# EAGLE design TestV3 (EAGLE 9.5.2)

## Sheet 1 of 3: STM32 MCU
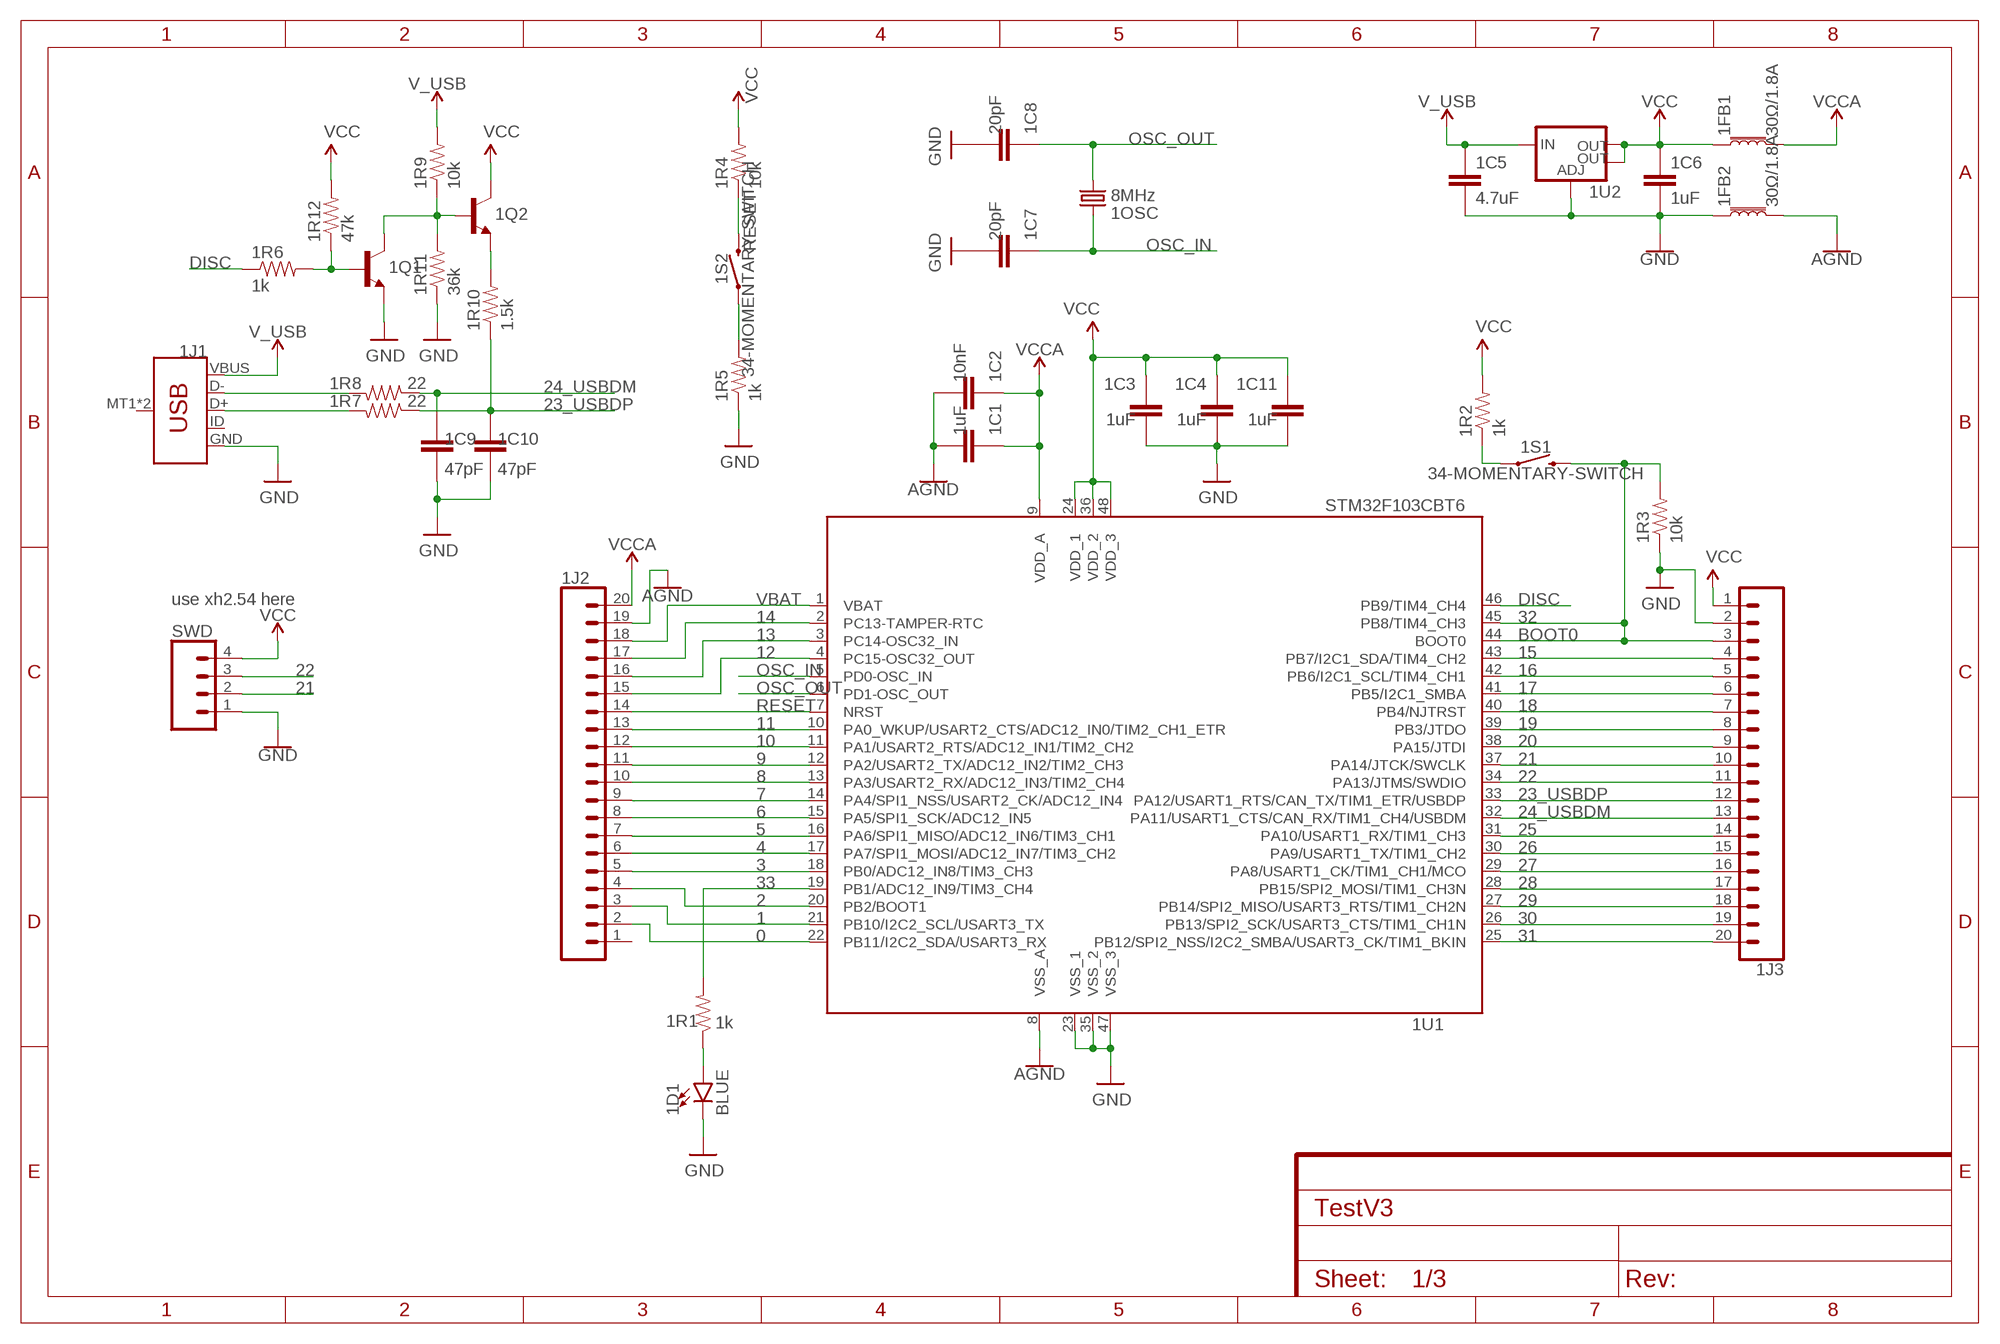
[diagram p0: schematic, sheet 1]

### Parts
1C1  1uF  CAPACITOR0603  [C0603]
1C2  10nF  CAPACITOR0603  [C0603]
1C3  1uF  CAPACITOR0603  [C0603]
1C4  1uF  CAPACITOR0603  [C0603]
1C5  4.7uF  CAPACITOR0603  [C0603]
1C6  1uF  CAPACITOR0603  [C0603]
1C7  20pF  CAPACITOR0603  [C0603]
1C8  20pF  CAPACITOR0603  [C0603]
1C9  47pF  CAPACITOR0603  [C0603]
1C10  47pF  CAPACITOR0603  [C0603]
1C11  1uF  CAPACITOR0603  [C0603]
1D1  BLUE  LED-BLUE0603  [LED-0603]
1FB1  30Ω/1.8A  FERRITE_BEAD-0603  [0603]
1FB2  30Ω/1.8A  FERRITE_BEAD-0603  [0603]
1J1  USB-MICROB  [USB-MICROB]
1J2  CONN_20LOCK  [1X20_LOCK]
1J3  CONN_20LOCK  [1X20_LOCK]
1OSC  8MHz  CRYSTALSMD-5X3.2-2PAD  [CRYSTAL-SMD-5X3.2-2PAD]
1Q1  600mA/40V  TRANS_NPN-MMBT2222AL  [SOT23-3]
1Q2  600mA/40V  TRANS_NPN-MMBT2222AL  [SOT23-3]
1R1  1k  RESISTOR0603  [R0603]
1R2  1k  RESISTOR0603  [R0603]
1R3  10k  RESISTOR0603  [R0603]
1R4  10k  RESISTOR0603  [R0603]
1R5  1k  RESISTOR0603  [R0603]
1R6  1k  RESISTOR0603  [R0603]
1R7  22  RESISTOR0603  [R0603]
1R8  22  RESISTOR0603  [R0603]
1R9  10k  RESISTOR0603  [R0603]
1R10  1.5k  RESISTOR0603  [R0603]
1R11  36k  RESISTOR0603  [R0603]
1R12  47k  RESISTOR0603  [R0603]
1S1  34-MOMENTARY-SWITCH  [3*4-MOMENTARY-SWITCH]
1S2  34-MOMENTARY-SWITCH  [3*4-MOMENTARY-SWITCH]
1U1  STM32F103CBT6  [LQFP48]
1U2  V_REG_LM1117SOT223  [SOT223]
SWD  CONN_04LOCK  [1X04_LOCK]

### Nets
0: 1J2.2 1U1.22(PB11/I2C2_SDA/USART3_RX)
1: 1J2.3 1U1.21(PB10/I2C2_SCL/USART3_TX)
2: 1J2.4 1U1.20(PB2/BOOT1)
3: 1J2.5 1U1.18(PB0/ADC12_IN8/TIM3_CH3)
4: 1J2.6 1U1.17(PA7/SPI1_MOSI/ADC12_IN7/TIM3_CH2)
5: 1J2.7 1U1.16(PA6/SPI1_MISO/ADC12_IN6/TIM3_CH1)
6: 1J2.8 1U1.15(PA5/SPI1_SCK/ADC12_IN5)
7: 1J2.9 1U1.14(PA4/SPI1_NSS/USART2_CK/ADC12_IN4)
8: 1J2.10 1U1.13(PA3/USART2_RX/ADC12_IN3/TIM2_CH4)
9: 1J2.11 1U1.12(PA2/USART2_TX/ADC12_IN2/TIM2_CH3)
10: 1J2.12 1U1.11(PA1/USART2_RTS/ADC12_IN1/TIM2_CH2)
11: 1J2.13 1U1.10(PA0_WKUP/USART2_CTS/ADC12_IN0/TIM2_CH1_ETR)
12: 1J2.15 1U1.4(PC15-OSC32_OUT)
13: 1J2.16 1U1.3(PC14-OSC32_IN)
14: 1J2.17 1U1.2(PC13-TAMPER-RTC)
15: 1J3.4 1U1.43(PB7/I2C1_SDA/TIM4_CH2)
16: 1J3.5 1U1.42(PB6/I2C1_SCL/TIM4_CH1)
17: 1J3.6 1U1.41(PB5/I2C1_SMBA)
18: 1J3.7 1U1.40(PB4/NJTRST)
19: 1J3.8 1U1.39(PB3/JTDO)
20: 1J3.9 1U1.38(PA15/JTDI)
21: 1J3.10 1U1.37(PA14/JTCK/SWCLK) SWD.2
22: 1J3.11 1U1.34(PA13/JTMS/SWDIO) SWD.3
23_USBDP: 1C10.2 1J3.12 1R7.1 1R10.1 1U1.33(PA12/USART1_RTS/CAN_TX/TIM1_ETR/USBDP)
24_USBDM: 1C9.2 1J3.13 1R8.1 1U1.32(PA11/USART1_CTS/CAN_RX/TIM1_CH4/USBDM)
25: 1J3.14 1U1.31(PA10/USART1_RX/TIM1_CH3)
26: 1J3.15 1U1.30(PA9/USART1_TX/TIM1_CH2)
27: 1J3.16 1U1.29(PA8/USART1_CK/TIM1_CH1/MCO)
28: 1J3.17 1U1.28(PB15/SPI2_MOSI/TIM1_CH3N)
29: 1J3.18 1U1.27(PB14/SPI2_MISO/USART3_RTS/TIM1_CH2N)
30: 1J3.19 1U1.26(PB13/SPI2_SCK/USART3_CTS/TIM1_CH1N)
31: 1J3.20 1U1.25(PB12/SPI2_NSS/I2C2_SMBA/USART3_CK/TIM1_BKIN)
32: 1J3.3 1R3.2 1S1.P2 1U1.44(BOOT0) 1U1.45(PB8/TIM4_CH3)
33: 1R1.2 1U1.19(PB1/ADC12_IN9/TIM3_CH4)
AGND: 1C1.2 1C2.2 1FB2.2 1J2.19 1U1.8(VSS_A)
DISC: 1R6.1 1U1.46(PB9/TIM4_CH4)
GND: 1C3.2 1C4.2 1C5.2 1C6.2 1C7.2 1C8.2 1C9.1 1C10.1 1C11.2 1D1.C 1FB2.1 1J1.GND 1J3.2 1Q1.2(E) 1R3.1 1R5.1 1R11.1 1U1.23(VSS_1) 1U1.35(VSS_2) 1U1.47(VSS_3) 1U2.1(ADJ) SWD.1
N$1: 1R2.1 1S1.P1
N$2: 1D1.A 1R1.1
N$4: 1R5.2 1S2.P1
N$51: 1Q2.2(E) 1R10.2
N$59: 1J1.D- 1R8.2
N$60: 1J1.D+ 1R7.2
N$71: 1Q1.3(C) 1Q2.1(B) 1R9.1 1R11.2
N$73: 1Q1.1(B) 1R6.2 1R12.1
OSC_IN: 1C7.1 1OSC.P$2 1U1.5(PD0-OSC_IN)
OSC_OUT: 1C8.1 1OSC.P$1 1U1.6(PD1-OSC_OUT)
RESET: 1J2.14 1R4.1 1S2.P2 1U1.7(NRST)
V_USB: 1C5.1 1J1.VBUS 1R9.2 1U2.3(IN)
VBAT: 1J2.18 1U1.1(VBAT)
VCC: 1C3.1 1C4.1 1C6.1 1C11.1 1FB1.1 1J3.1 1Q2.3(C) 1R2.2 1R4.2 1R12.2 1U1.24(VDD_1) 1U1.36(VDD_2) 1U1.48(VDD_3) 1U2.2(OUT) 1U2.4(OUT) SWD.4
VCCA: 1C1.1 1C2.1 1FB1.2 1J2.20 1U1.9(VDD_A)
Unconnected: 1J1.ID 1J1.MT1(SHIELD) 1J1.MT2(SHIELD) 1J2.1

### Notes on the sheet
- use xh2.54 here
- BOOT0

## Sheet 2 of 3: Buck & Boost Converters
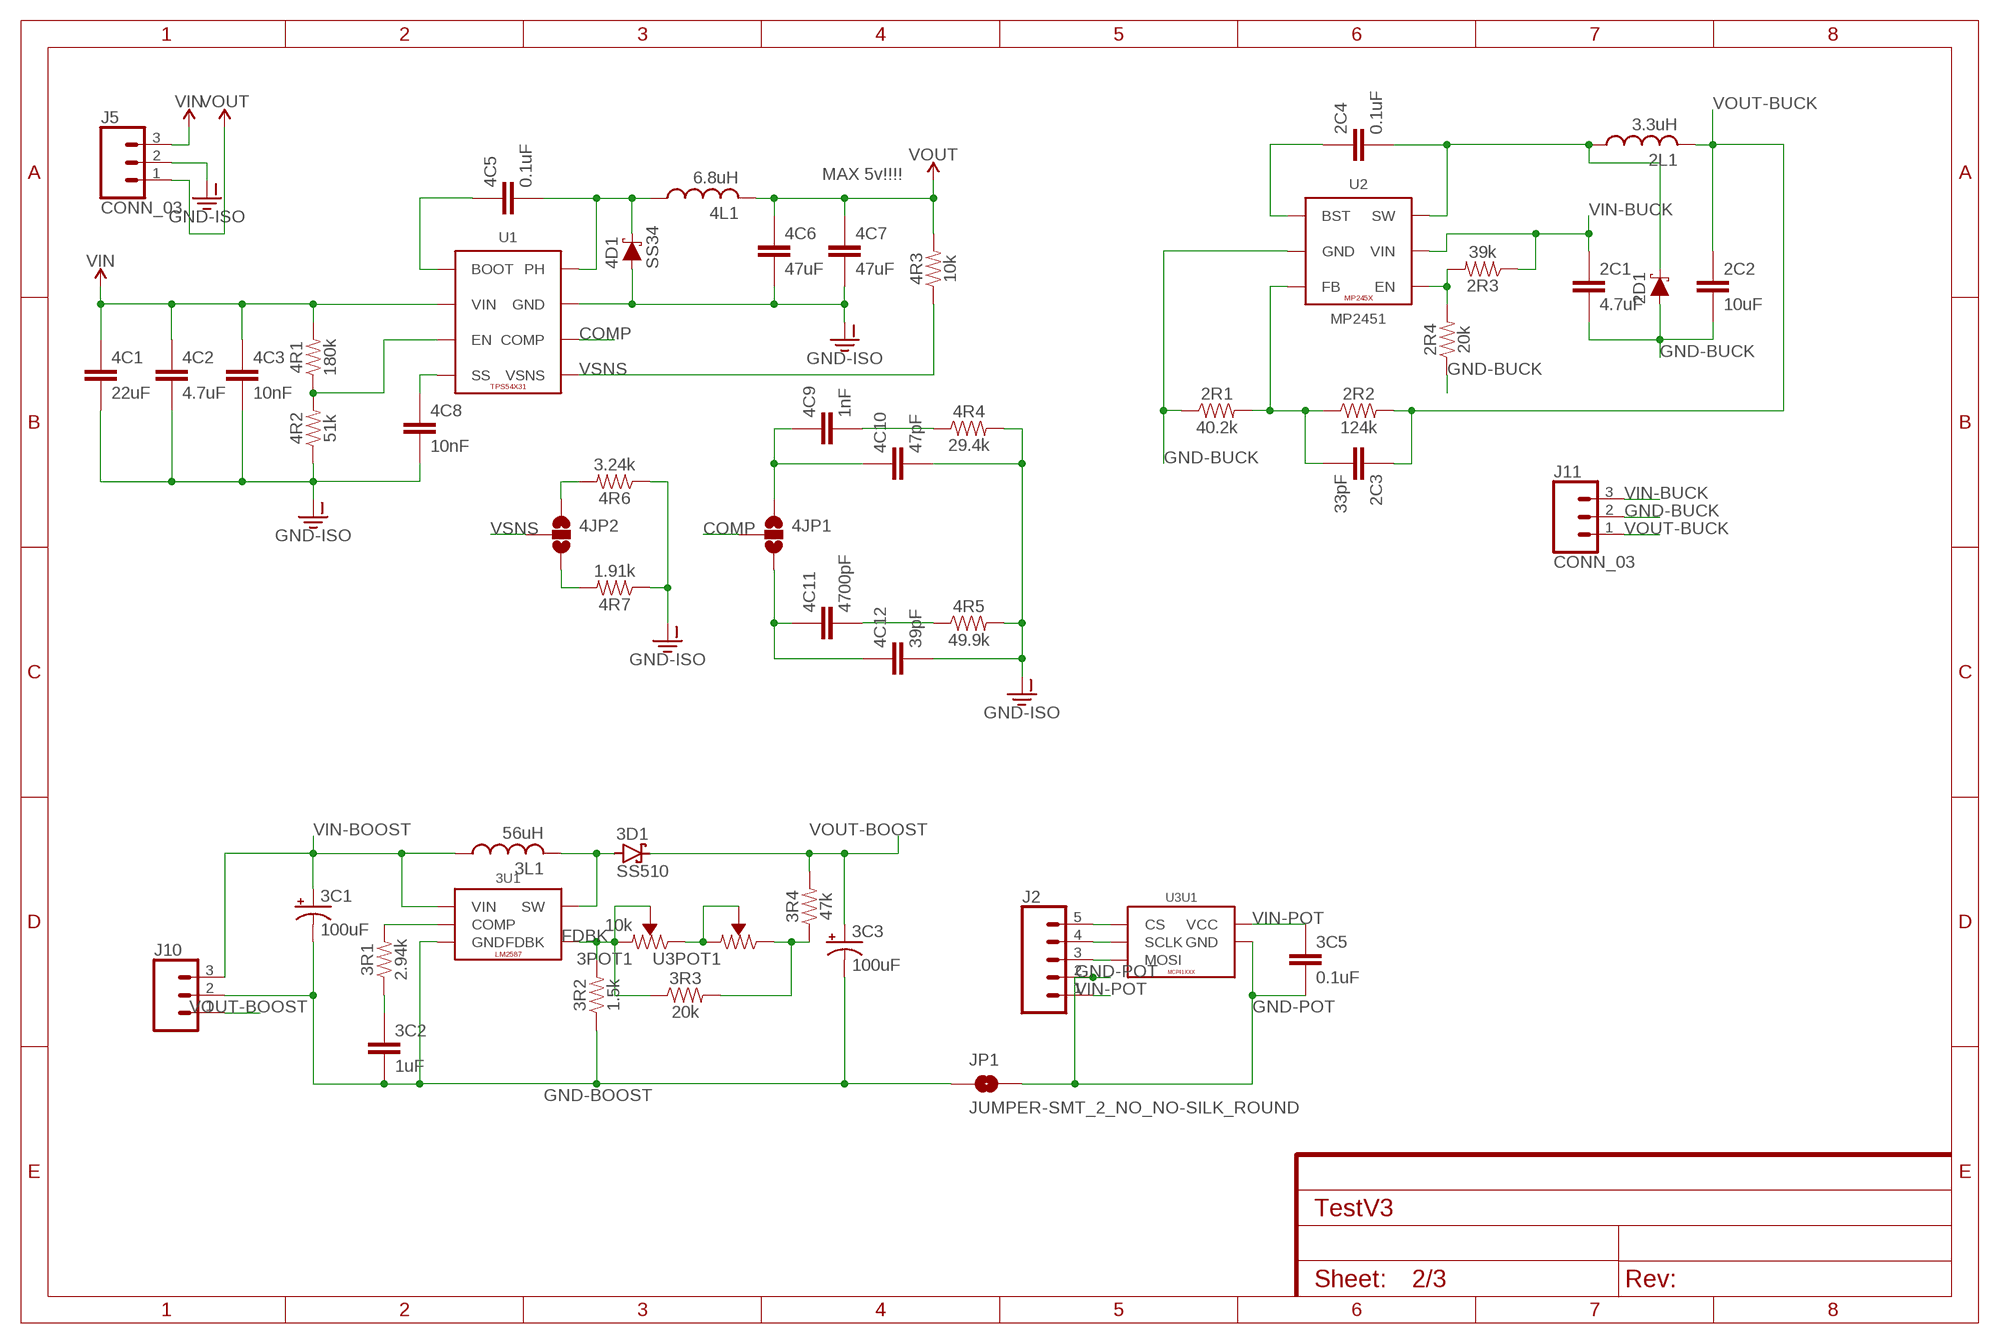
[diagram p1: schematic, sheet 2]

### Parts
2C1  4.7uF  CAPACITOR0603  [C0603]
2C2  10uF  CAPACITOR0603  [C0603]
2C3  33pF  CAPACITOR0603  [C0603]
2C4  0.1uF  CAPACITOR0603  [C0603]
2D1  SS34  DIODE-SCHOTTKY  [SMA-DIODE]
2L1  3.3uH  INDUCTORSWPA4030  [SWPA4030]
2R1  40.2k  RESISTOR0603  [R0603]
2R2  124k  RESISTOR0603  [R0603]
2R3  39k  RESISTOR0603  [R0603]
2R4  20k  RESISTOR0603  [R0603]
3C1  100uF  100UF-POLAR-25V-20%(ELEC)  [PANASONIC_D]
3C2  1uF  CAPACITOR0603  [C0603]
3C3  100uF  100UF-POLAR-10X10.5-63V-20%  [NIC_10X10.5_CAP]
3C5  0.1uF  CAPACITOR0603  [C0603]
3D1  SS510  SCHOTTKY-DIODESMD  [SMB]
3L1  56uH  INDUCTORCDRH127  [CDRH127]
3POT1  10k  3296-TRIMPOT  [3296-TRIMPOT]
3R1  2.94k  RESISTOR0603  [R0603]
3R2  1.5k  RESISTOR0603  [R0603]
3R3  20k  RESISTOR0603  [R0603]
3R4  47k  RESISTOR0603  [R0603]
3U1  LM2587  [TO-263]
4C1  22uF  CAPACITOR1210  [C1210]
4C2  4.7uF  CAPACITOR0603  [C0603]
4C3  10nF  CAPACITOR0603  [C0603]
4C5  0.1uF  CAPACITOR0603  [C0603]
4C6  47uF  CAPACITOR1206  [C1206]
4C7  47uF  CAPACITOR1206  [C1206]
4C8  10nF  CAPACITOR0603  [C0603]
4C9  1nF  CAPACITOR0603  [C0603]
4C10  47pF  CAPACITOR0603  [C0603]
4C11  4700pF  CAPACITOR0603  [C0603]
4C12  39pF  CAPACITOR0603  [C0603]
4D1  SS34  DIODE-SCHOTTKY  [SMA-DIODE]
4JP1  JUMPER-SMT_3_NO_NO-SILK  [SMT-JUMPER_3_NO_NO-SILK]
4JP2  JUMPER-SMT_3_NO_NO-SILK  [SMT-JUMPER_3_NO_NO-SILK]
4L1  6.8uH  INDUCTORSWPA8040  [SWPA8040]
4R1  180k  RESISTOR0603  [R0603]
4R2  51k  RESISTOR0603  [R0603]
4R3  10k  RESISTOR0603  [R0603]
4R4  29.4k  RESISTOR0603  [R0603]
4R5  49.9k  RESISTOR0603  [R0603]
4R6  3.24k  RESISTOR0603  [R0603]
4R7  1.91k  RESISTOR0603  [R0603]
J2  CONN_05LOCK  [1X05_LOCK]
J5  CONN_03  [1X03_LOCK]
J10  CONN_03-SCREW-5MM  [SCREWTERMINAL-5MM-3]
J11  CONN_03  [1X03_LOCK]
JP1  JUMPER-SMT_2_NO_NO-SILK_ROUND  [SMT-JUMPER_2_NO_NO-SILK_ROUND]
U1  TPS54X31  [POWERPAD-SOIC-8]
U2  MP2451  MP245X  [SOT23-6-MP]
U3  MCP41XXX  [SOIC-8]

### Nets
COMP: 4JP1.2 U1.6(COMP)
FDBK: 3POT1.1(CCW) 3POT1.2(WIPER) 3R2.2 3R3.1 3U1.P2(FDBK)
GND-BOOST: 3C1.- 3C2.2 3C3.- 3R2.1 3U1.P3(GND) 3U1.P$1(GND) 3U1.P$2(GND) 3U1.P$3(GND) 3U1.P$4(GND) 3U1.P$5(GND) 3U1.P$6(GND) 3U1.P$7(GND) 3U1.P$8(GND) 3U1.P$9(GND) 3U1.P$10(GND) 3U1.P$11(GND) 3U1.P$12(GND) 3U1.P$13(GND) 3U1.P$14(GND) 3U1.P$15(GND) 3U1.P$16(GND) 3U1.P$17(GND) 3U1.P$18(GND) 3U1.P$19(GND) 3U1.P$20(GND) 3U1.TAB(GND) J10.2 JP1.1
GND-BUCK: 2C1.2 2C2.2 2D1.A 2R1.1 2R4.1 J11.2 U2.P2(GND)
GND-ISO: 4C1.2 4C2.2 4C3.2 4C6.2 4C7.2 4C8.2 4C10.2 4C12.2 4D1.A 4R2.1 4R4.2 4R5.2 4R6.1 4R7.1 J5.2 U1.7(GND) U1.9(GND) U1.P$1(GND) U1.P$2(GND) U1.P$3(GND) U1.P$4(GND) U1.P$5(GND) U1.P$6(GND)
GND-POT: 3C5.2 J2.2 JP1.2 U3.4(U1:GND)
N$3: 2C3.2 2R1.2 2R2.1 U2.P3(FB)
N$5: 2C4.2 2D1.C 2L1.P1 U2.P6(SW)
N$6: 2C4.1 U2.P1(BST)
N$8: 4C8.1 U1.4(SS)
N$9: 4C5.1 U1.1(BOOT)
N$10: 4C5.2 4D1.C 4L1.P1 U1.8(PH)
N$11: 4R1.1 4R2.2 U1.3(EN)
N$12: 4C9.2 4R4.1
N$15: 4C9.1 4C10.1 4JP1.1
N$16: 3POT1.3(CW) U3.5(POT1:CCW) U3.6(POT1:WIPER)
N$18: 3R3.2 3R4.1 U3.7(POT1:CW)
N$20: 2R3.2 2R4.2 U2.P4(EN)
N$22: J2.3 U3.3(U1:MOSI)
N$23: J2.4 U3.2(U1:SCLK)
N$24: J2.5 U3.1(U1:CS)
N$34: 3D1.A 3L1.2 3U1.P4(SW)
N$36: 3R1.2 3U1.P1(COMP)
N$37: 3C2.1 3R1.1
N$52: 4C11.2 4R5.1
N$54: 4C11.1 4C12.1 4JP1.3
N$57: 4JP2.1 4R6.2
N$58: 4JP2.3 4R7.2
VIN: 4C1.1 4C2.1 4C3.1 4R1.2 J5.3 U1.2(VIN)
VIN-BOOST: 3C1.+ 3L1.1 3U1.P5(VIN) J10.3
VIN-BUCK: 2C1.1 2R3.1 J11.3 U2.P5(VIN)
VIN-POT: 3C5.1 J2.1 U3.8(U1:VCC)
VOUT: 4C6.1 4C7.1 4L1.P2 4R3.2 J5.1
VOUT-BOOST: 3C3.+ 3D1.C 3R4.2 J10.1
VOUT-BUCK: 2C2.1 2C3.1 2L1.P2 2R2.2 J11.1
VSNS: 4JP2.2 4R3.1 U1.5(VSNS)

### Notes on the sheet
- MAX 5v!!!!

## Sheet 3 of 3: Motor Driver, Low Battery, Color Sensor
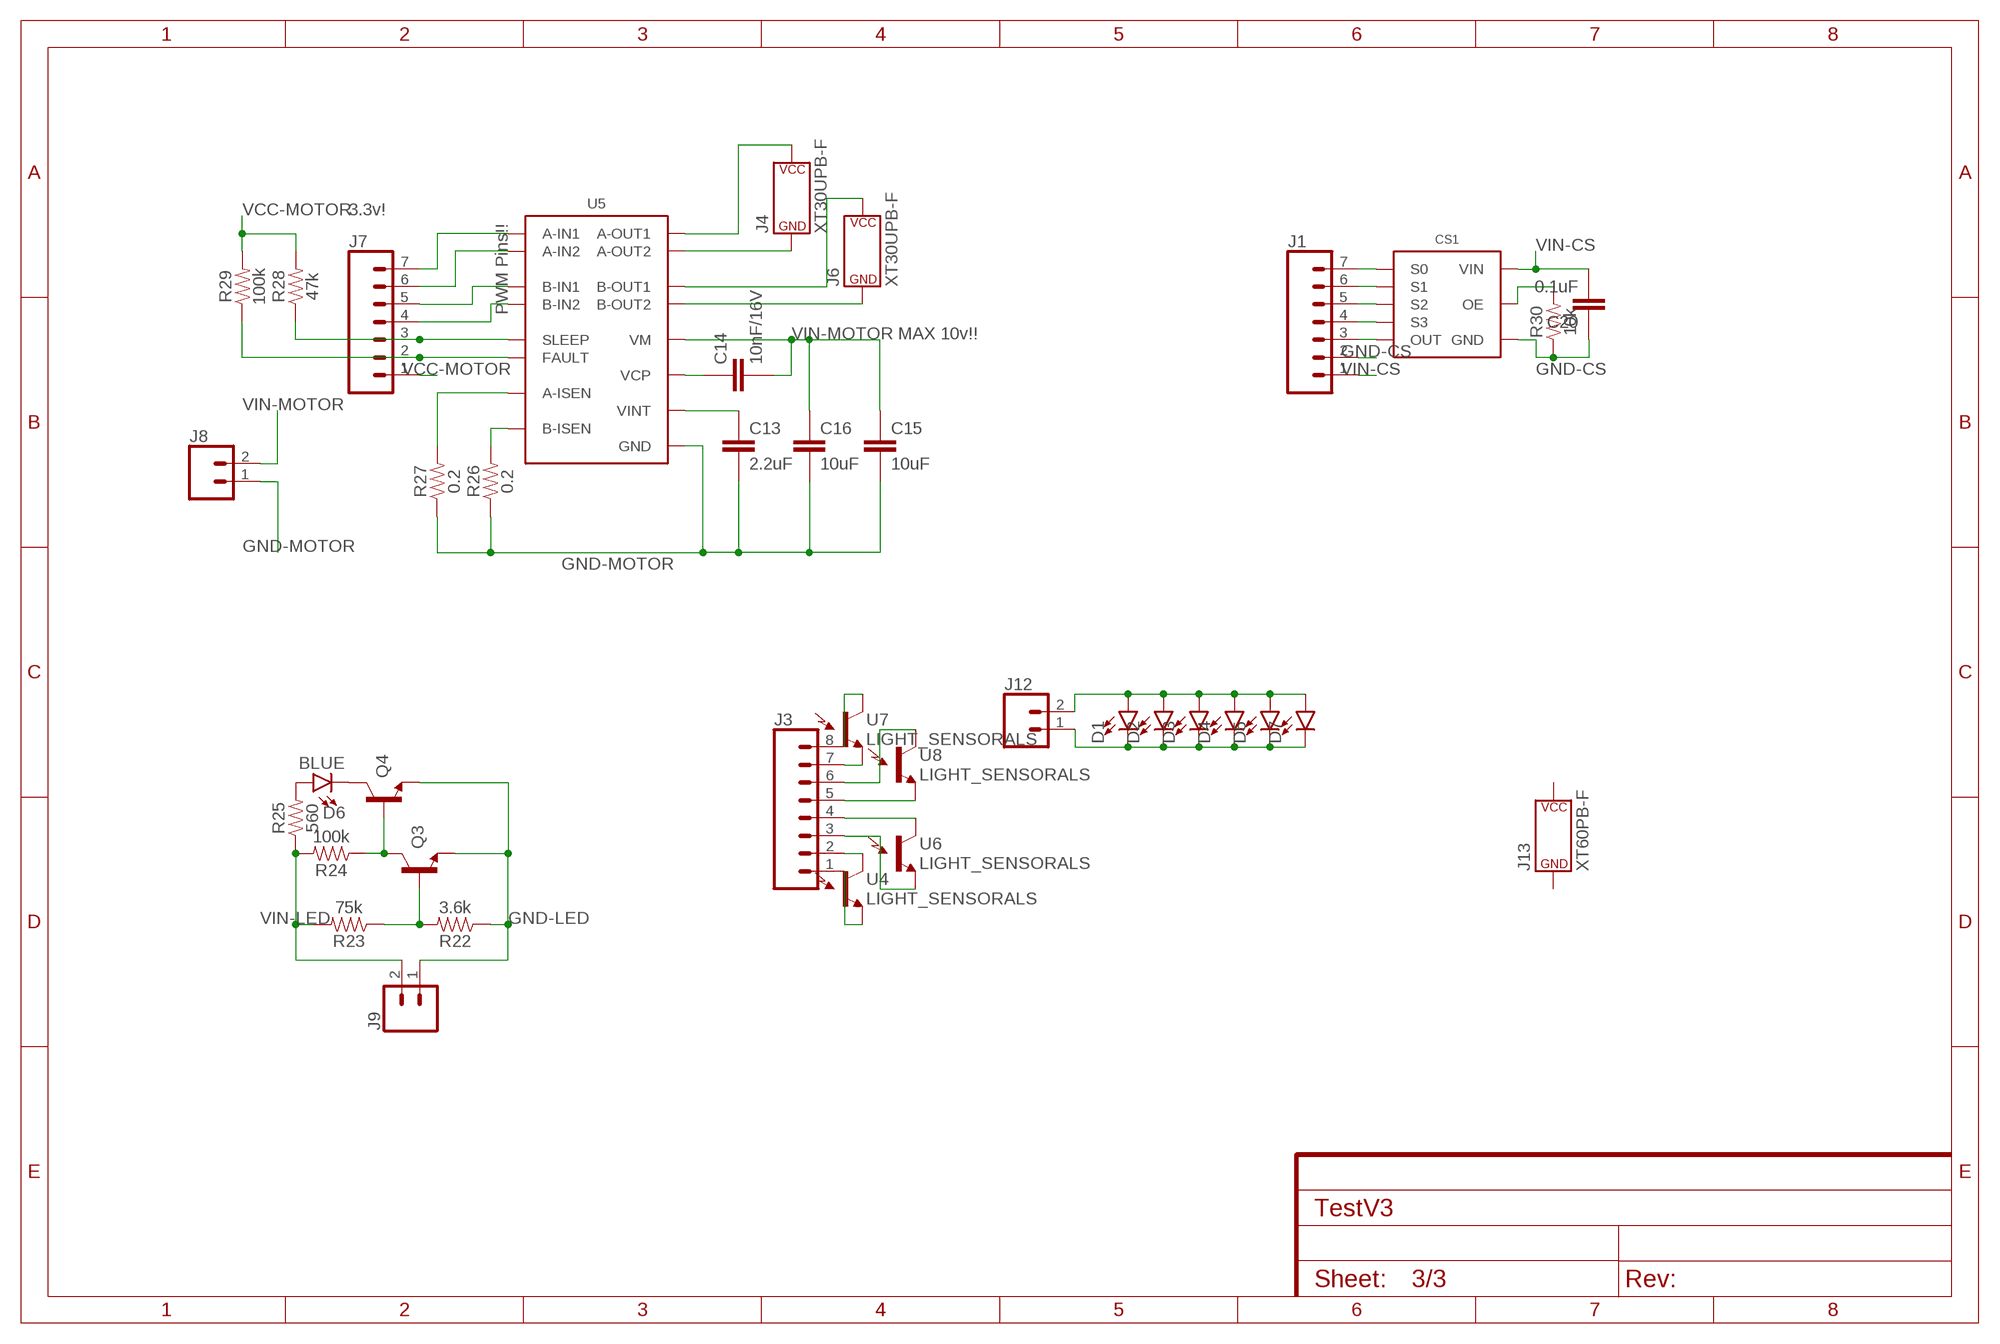
[diagram p2: schematic, sheet 3]

### Parts
C13  2.2uF  CAPACITOR0603  [C0603]
C14  10nF/16V  CAPACITOR0603  [C0603]
C15  10uF  CAPACITOR0805  [C0805]
C16  10uF  CAPACITOR0805  [C0805]
C20  0.1uF  CAPACITOR0603  [C0603]
CS1  TCS3200  [SOIC-8]
D1  3528LED  [3528]
D2  3528LED  [3528]
D3  3528LED  [3528]
D4  3528LED  [3528]
D5  3528LED  [3528]
D6  BLUE  LED-BLUE0603  [LED-0603]
D7  3528LED  [3528]
J1  CONN_07LOCK  [1X07_LOCK]
J3  CONN_08LOCK  [1X08_LOCK]
J4  XT30UPB-F  [XT30UPB-F]
J6  XT30UPB-F  [XT30UPB-F]
J7  CONN_07LOCK  [1X07_LOCK]
J8  CONN_025MM  [SCREWTERMINAL-5MM-2]
J9  CONN_02LOCK  [1X02_LOCK]
J12  CONN_02LOCK  [1X02_LOCK]
J13  XT60PB-F  [XT60PB-F]
Q3  600mA/40V  TRANS_NPN-MMBT2222AL  [SOT23-3]
Q4  600mA/40V  TRANS_NPN-MMBT2222AL  [SOT23-3]
R22  3.6k  RESISTOR0603  [R0603]
R23  75k  RESISTOR0603  [R0603]
R24  100k  RESISTOR0603  [R0603]
R25  560  RESISTOR0603  [R0603]
R26  0.2  RESISTOR0603  [R0603]
R27  0.2  RESISTOR0603  [R0603]
R28  47k  RESISTOR0603  [R0603]
R29  100k  RESISTOR0603  [R0603]
R30  10k  RESISTOR0603  [R0603]
U4  LIGHT_SENSORALS  [ALS-PT19]
U5  DRV8833  [SSOP16]
U6  LIGHT_SENSORALS  [ALS-PT19]
U7  LIGHT_SENSORALS  [ALS-PT19]
U8  LIGHT_SENSORALS  [ALS-PT19]

### Nets
GND-CS: C20.1 CS1.4(GND) J1.2 R30.1
GND-LED: J9.1 Q3.2(E) Q4.2(E) R22.1
GND-MOTOR: C13.2 C15.2 C16.2 J8.1 R26.1 R27.1 U5.13(GND) U5.PPAD(GND)
N$7: D1.A D2.A D3.A D4.A D5.A D7.A J12.2
N$13: D1.C D2.C D3.C D4.C D5.C D7.C J12.1
N$14: J3.2 U4.C(C1)
N$17: J3.1 U4.E(E1)
N$19: J3.4 U6.C(C1)
N$21: Q3.3(C) Q4.1(B) R24.1
N$25: D6.A R25.2
N$26: D6.C Q4.3(C)
N$27: J7.7 U5.16(A-IN1)
N$28: Q3.1(B) R22.2 R23.1
N$29: J7.6 U5.15(A-IN2)
N$30: J7.5 U5.9(B-IN1)
N$31: J7.4 U5.10(B-IN2)
N$32: J7.3 R28.1 U5.1(SLEEP)
N$33: J7.2 R29.1 U5.8(FAULT)
N$35: R26.2 U5.6(B-ISEN)
N$38: R27.2 U5.3(A-ISEN)
N$39: J4.+(P$V+) U5.2(A-OUT1)
N$40: J4.-(P$V-) U5.4(A-OUT2)
N$41: J6.+(P$V+) U5.7(B-OUT1)
N$42: J6.-(P$V-) U5.5(B-OUT2)
N$43: C14.1 U5.11(VCP)
N$44: C13.1 U5.14(VINT)
N$45: CS1.1(S0) J1.7
N$46: CS1.2(S1) J1.6
N$47: CS1.7(S2) J1.5
N$48: CS1.8(S3) J1.4
N$49: CS1.6(OUT) J1.3
N$50: CS1.3(OE) R30.2
N$56: J3.3 U6.E(E1)
N$61: J3.8 U7.C(C1)
N$62: J3.7 U7.E(E1)
N$63: J3.5 U8.E(E1)
N$64: J3.6 U8.C(C1)
VCC-MOTOR: J7.1 R28.2 R29.2
VIN-CS: C20.2 CS1.5(VIN) J1.1
VIN-LED: J9.2 R23.2 R24.2 R25.1
VIN-MOTOR: C14.2 C15.1 C16.1 J8.2 U5.12(VM)
Unconnected: J13.+(P$V+) J13.-(P$V-)

### Notes on the sheet
- 3.3v!
- PWM Pins!!
- MAX 10v!!

## Library data of the parts
1C1-1C11 2C1-2C4 3C2 3C5 4C1-4C3 4C5-4C12 C13 C14 C20 = JH:CAPACITOR
1D1 D6 = SparkFun-LED:LED-BLUE: Blue SMD LED Used in manufacturing of various products at SparkFun Packages: 0603 - SMD 0603 package [Product Link] <http://www.digikey.com/product-detail/en/SMLE12BC7TT86/511-1589-2-ND/1641808> 1206 - SMD1206 package [Product Link] <http://www.digikey.com/product-detail/en/lite-on-inc/LTST-C150TBKT/160-1643-1-ND/573584> SparkFun Products: ESP8266 Thing-Dev Board <https://www.sparkfun.com/products/13711> RedBoard <https://www.sparkfun.com/products/12757>; PROD_ID: DIO-08575
1FB1 1FB2 = SparkFun-Coils:FERRITE_BEAD: Ferrite Bead (blocks, cores, rings, chokes, etc.) Inductor with layers of ferrite used to suppress high frequencies. Often used to isolate high frequency noise. SparkFun Products: IOIO-OTG - V2.2 <https://www.sparkfun.com/products/13613> SparkFun SAMD21 Mini Breakout <https://www.sparkfun.com/products/13664> SparkFun 6 Degrees of Freedom Breakout - LSM6DS3 <https://www.sparkfun.com/products/13339> SparkFun SAMD21 Dev Breakout <https://www.sparkfun.com/products/13672>; PROD_ID: NDUC-07859
1J1 = JH:USB-MICROB
1J2 1J3 = SparkFun-Connectors:CONN_20: Multi connection point. Often used as Generic Header-pin footprint for 0.1 inch spaced/style header connections On any of the 0.1 inch spaced packages, you can populate with these: Break Away Headers - Straight <https://www.sparkfun.com/products/116> (PRT-00116) Break Away Male Headers - Right Angle <https://www.sparkfun.com/products/553> (PRT-00553) Female Headers <https://www.sparkfun.com/products/115> (PRT-00115) Break Away Headers - Machine Pin <https://www.sparkfun.com/products/117> (PRT-00117) Break Away Female Headers - Swiss Machine Pin <https://www.sparkfun.com/products/743> (PRT-00743) For SCREWTERMINALS and SPRING TERMINALS visit here: Screw Terimnals on SparkFun.com <https://www.sparkfun.com/search/results?term=Screw+Terminals> (5mm/3.5mm/2.54mm spacing) This device is also useful as a general connection point to wire up your design to another part of your project. Our various solder wires solder well into these plated through hole pads. Hook-Up Wire - Assortment (Stranded, 22 AWG) <https://www.sparkfun.com/products/11375> (PRT-11375) Hook-Up Wire - Assortment (Solid Core, 22 AWG) <https://www.sparkfun.com/products/11367> (PRT-11367) View the entire wire category on our website here <https://www.sparkfun.com/categories/141> Special notes: Molex polarized connector foot print use with SKU : PRT-08231 with associated crimp pins and housings. 1MM SMD Version SKU: PRT-10208 NOTES ON THE VARIANTS LOCK and LOCK_LONGPADS... This footprint was designed to help hold the alignment of a through-hole component (i.e. 6-pin header) while soldering it into place. You may notice that each hole has been shifted either up or down by 0.005 of an inch from it's more standard position (which is a perfectly straight line). This slight alteration caused the pins (the squares in the middle) to touch the edges of the holes. Because they are alternating, it causes a "brace" to hold the component in place. 0.005 has proven to be the perfect amount of "off-center" position when using our standard breakaway headers. Although looks a little odd when you look at the bare footprint, once you have a header in there, the alteration is very hard to notice. Also,if you push a header all the way into place, it is covered up entirely on the bottom side. Note about LOCK SPECIAL package: This is just like the LOCK variant in that the holes are staggared by 5 mil, but except for the last two holes. They are not altered from the "standard" footprint layout. This is used for a special purpose on the layout of our Graphic LCD Backpack. Make sure you want to use this device before selecting it for you project!
1OSC = SparkFun-Clocks:CRYSTAL: Crystals (Generic) These are passive quartz crystals, which can be used as a clock source for a microcontroller. Crystal's are two-terminal devices. They require external "load" capacitors to generate an oscillating signal.
1Q1 1Q2 Q3 Q4 = SparkFun-DiscreteSemi:TRANS_NPN: NPN transistor Current controlled devices typically used to amplify current or used as a switch. BC547 - COM-08928 <http://www.sparkfun.com/products/8928> (TO-92 45V 100mA) (1.Collector 2.Base 3.Emitter) 2N3904 - COM-00521 <http://www.sparkfun.com/products/521> (TO-92 40V 200mA) (1.Emitter 2.Base 3.Collector) P2N2222A - COM-12852 <http://www.sparkfun.com/products/12852> (TO-92 40V 600mA) (1.Collector 2.Base 3.Emitter); PROD_ID: TRANS-08049
1R1-1R12 2R1-2R4 3R1-3R4 4R1-4R7 R22-R30 = JH:RESISTOR
1S1 1S2 = JH:3*4-MOMENTARY-SWITCH
1U1 = JH:STM32F103CBT6
1U2 = SparkFun-IC-Power:V_REG_LM1117: Voltage Regulator LM1117 Standard adjustable voltage regulator but in SMD form. Spark Fun Electronics SKU : COM-00595; PROD_ID: VREG-08170
2D1 4D1 = JH:DIODE-SCHOTTKY
2L1 3L1 4L1 = JH:INDUCTOR
3C1 = SparkFun-Capacitors:100UF-POLAR: 100µF polarized capacitors A capacitor is a passive two-terminal electrical component used to store electrical energy temporarily in an electric field.; PROD_ID: CAP-12547
3C3 = SparkFun-Capacitors:100UF-POLAR: 100µF polarized capacitors A capacitor is a passive two-terminal electrical component used to store electrical energy temporarily in an electric field.; PROD_ID: CAP-08362
3D1 = diode:SCHOTTKY-DIODE: Schottky Diode
3POT1 = JH:3296-TRIMPOT
3U1 = JH:LM2587
4JP1 4JP2 = SparkFun-Jumpers:JUMPER-SMT_3_NO: Normally open jumper This jumper has three pads in close proximity to each other. Apply solder to close the connection(s).
C15 C16 = JH:CAPACITOR; VOLTAGE: 16V
CS1 = JH:TCS3200
D1-D5 D7 = JH:3528LED
J1 J7 = SparkFun-Connectors:CONN_07: Multi connection point. Often used as Generic Header-pin footprint for 0.1 inch spaced/style header connections On any of the 0.1 inch spaced packages, you can populate with these: Break Away Headers - Straight <https://www.sparkfun.com/products/116> (PRT-00116) Break Away Male Headers - Right Angle <https://www.sparkfun.com/products/553> (PRT-00553) Female Headers <https://www.sparkfun.com/products/115> (PRT-00115) Break Away Headers - Machine Pin <https://www.sparkfun.com/products/117> (PRT-00117) Break Away Female Headers - Swiss Machine Pin <https://www.sparkfun.com/products/743> (PRT-00743) For SCREWTERMINALS and SPRING TERMINALS visit here: Screw Terimnals on SparkFun.com <https://www.sparkfun.com/search/results?term=Screw+Terminals> (5mm/3.5mm/2.54mm spacing) This device is also useful as a general connection point to wire up your design to another part of your project. Our various solder wires solder well into these plated through hole pads. Hook-Up Wire - Assortment (Stranded, 22 AWG) <https://www.sparkfun.com/products/11375> (PRT-11375) Hook-Up Wire - Assortment (Solid Core, 22 AWG) <https://www.sparkfun.com/products/11367> (PRT-11367) View the entire wire category on our website here <https://www.sparkfun.com/categories/141> Special notes: Molex polarized connector foot print use with SKU : PRT-08231 with associated crimp pins and housings. 1MM SMD Version SKU: PRT-10208 NOTES ON THE VARIANTS LOCK and LOCK_LONGPADS... This footprint was designed to help hold the alignment of a through-hole component (i.e. 6-pin header) while soldering it into place. You may notice that each hole has been shifted either up or down by 0.005 of an inch from it's more standard position (which is a perfectly straight line). This slight alteration caused the pins (the squares in the middle) to touch the edges of the holes. Because they are alternating, it causes a "brace" to hold the component in place. 0.005 has proven to be the perfect amount of "off-center" position when using our standard breakaway headers. Although looks a little odd when you look at the bare footprint, once you have a header in there, the alteration is very hard to notice. Also,if you push a header all the way into place, it is covered up entirely on the bottom side.
J2 = SparkFun-Connectors:CONN_05: Multi connection point. Often used as Generic Header-pin footprint for 0.1 inch spaced/style header connections On any of the 0.1 inch spaced packages, you can populate with these: Break Away Headers - Straight <https://www.sparkfun.com/products/116> (PRT-00116) Break Away Male Headers - Right Angle <https://www.sparkfun.com/products/553> (PRT-00553) Female Headers <https://www.sparkfun.com/products/115> (PRT-00115) Break Away Headers - Machine Pin <https://www.sparkfun.com/products/117> (PRT-00117) Break Away Female Headers - Swiss Machine Pin <https://www.sparkfun.com/products/743> (PRT-00743) For SCREWTERMINALS and SPRING TERMINALS visit here: Screw Terimnals on SparkFun.com <https://www.sparkfun.com/search/results?term=Screw+Terminals> (5mm/3.5mm/2.54mm spacing) This device is also useful as a general connection point to wire up your design to another part of your project. Our various solder wires solder well into these plated through hole pads. Hook-Up Wire - Assortment (Stranded, 22 AWG) <https://www.sparkfun.com/products/11375> (PRT-11375) Hook-Up Wire - Assortment (Solid Core, 22 AWG) <https://www.sparkfun.com/products/11367> (PRT-11367) View the entire wire category on our website here <https://www.sparkfun.com/categories/141> Special notes: Molex polarized connector foot print use with SKU : PRT-08231 with associated crimp pins and housings. 1MM SMD Version SKU: PRT-10208
J3 = SparkFun-Connectors:CONN_08: Multi connection point. Often used as Generic Header-pin footprint for 0.1 inch spaced/style header connections On any of the 0.1 inch spaced packages, you can populate with these: Break Away Headers - Straight <https://www.sparkfun.com/products/116> (PRT-00116) Break Away Male Headers - Right Angle <https://www.sparkfun.com/products/553> (PRT-00553) Female Headers <https://www.sparkfun.com/products/115> (PRT-00115) Break Away Headers - Machine Pin <https://www.sparkfun.com/products/117> (PRT-00117) Break Away Female Headers - Swiss Machine Pin <https://www.sparkfun.com/products/743> (PRT-00743) Arduino Stackable Header - 8 Pin <https://www.sparkfun.com/products/9279> (PRT-09279) For SCREWTERMINALS and SPRING TERMINALS visit here: Screw Terimnals on SparkFun.com <https://www.sparkfun.com/search/results?term=Screw+Terminals> (5mm/3.5mm/2.54mm spacing) This device is also useful as a general connection point to wire up your design to another part of your project. Our various solder wires solder well into these plated through hole pads. Hook-Up Wire - Assortment (Stranded, 22 AWG) <https://www.sparkfun.com/products/11375> (PRT-11375) Hook-Up Wire - Assortment (Solid Core, 22 AWG) <https://www.sparkfun.com/products/11367> (PRT-11367) View the entire wire category on our website here <https://www.sparkfun.com/categories/141> Special notes: Molex polarized connector foot print use with SKU : PRT-08231 with associated crimp pins and housings. 1MM SMD Version SKU: PRT-10208 NOTES ON THE VARIANTS LOCK and LOCK_LONGPADS... This footprint was designed to help hold the alignment of a through-hole component (i.e. 6-pin header) while soldering it into place. You may notice that each hole has been shifted either up or down by 0.005 of an inch from it's more standard position (which is a perfectly straight line). This slight alteration caused the pins (the squares in the middle) to touch the edges of the holes. Because they are alternating, it causes a "brace" to hold the component in place. 0.005 has proven to be the perfect amount of "off-center" position when using our standard breakaway headers. Although looks a little odd when you look at the bare footprint, once you have a header in there, the alteration is very hard to notice. Also,if you push a header all the way into place, it is covered up entirely on the bottom side.
J4 J6 = JH:XT30UPB-F
J5 J11 = JH:CONN_03
J8 = SparkFun-Connectors:CONN_02: Multi connection point. Often used as Generic Header-pin footprint for 0.1 inch spaced/style header connections On any of the 0.1 inch spaced packages, you can populate with these: Break Away Headers - Straight <https://www.sparkfun.com/products/116> (PRT-00116) Break Away Male Headers - Right Angle <https://www.sparkfun.com/products/553> (PRT-00553) Female Headers <https://www.sparkfun.com/products/115> (PRT-00115) Break Away Headers - Machine Pin <https://www.sparkfun.com/products/117> (PRT-00117) Break Away Female Headers - Swiss Machine Pin <https://www.sparkfun.com/products/743> (PRT-00743) For SCREWTERMINALS and SPRING TERMINALS visit here: Screw Terimnals on SparkFun.com <https://www.sparkfun.com/search/results?term=Screw+Terminals> (5mm/3.5mm/2.54mm spacing) This device is also useful as a general connection point to wire up your design to another part of your project. Our various solder wires solder well into these plated through hole pads. Hook-Up Wire - Assortment (Stranded, 22 AWG) <https://www.sparkfun.com/products/11375> (PRT-11375) Hook-Up Wire - Assortment (Solid Core, 22 AWG) <https://www.sparkfun.com/products/11367> (PRT-11367) View the entire wire category on our website here <https://www.sparkfun.com/categories/141> Special notes: Molex polarized connector foot print use with: PRT-08233 with associated crimp pins and housings. 2.54_SCREWTERM for use with PRT-10571. 3.5mm Screw Terminal footprints for PRT-08084 5mm Screw Terminal footprints for use with PRT-08432; SF_SKU: PRT-08432
J9 J12 = SparkFun-Connectors:CONN_02: Multi connection point. Often used as Generic Header-pin footprint for 0.1 inch spaced/style header connections On any of the 0.1 inch spaced packages, you can populate with these: Break Away Headers - Straight <https://www.sparkfun.com/products/116> (PRT-00116) Break Away Male Headers - Right Angle <https://www.sparkfun.com/products/553> (PRT-00553) Female Headers <https://www.sparkfun.com/products/115> (PRT-00115) Break Away Headers - Machine Pin <https://www.sparkfun.com/products/117> (PRT-00117) Break Away Female Headers - Swiss Machine Pin <https://www.sparkfun.com/products/743> (PRT-00743) For SCREWTERMINALS and SPRING TERMINALS visit here: Screw Terimnals on SparkFun.com <https://www.sparkfun.com/search/results?term=Screw+Terminals> (5mm/3.5mm/2.54mm spacing) This device is also useful as a general connection point to wire up your design to another part of your project. Our various solder wires solder well into these plated through hole pads. Hook-Up Wire - Assortment (Stranded, 22 AWG) <https://www.sparkfun.com/products/11375> (PRT-11375) Hook-Up Wire - Assortment (Solid Core, 22 AWG) <https://www.sparkfun.com/products/11367> (PRT-11367) View the entire wire category on our website here <https://www.sparkfun.com/categories/141> Special notes: Molex polarized connector foot print use with: PRT-08233 with associated crimp pins and housings. 2.54_SCREWTERM for use with PRT-10571. 3.5mm Screw Terminal footprints for PRT-08084 5mm Screw Terminal footprints for use with PRT-08432
J10 = SparkFun-Connectors:CONN_03: Multi connection point. Often used as Generic Header-pin footprint for 0.1 inch spaced/style header connections On any of the 0.1 inch spaced packages, you can populate with these: Break Away Headers - Straight <https://www.sparkfun.com/products/116> (PRT-00116) Break Away Male Headers - Right Angle <https://www.sparkfun.com/products/553> (PRT-00553) Female Headers <https://www.sparkfun.com/products/115> (PRT-00115) Break Away Headers - Machine Pin <https://www.sparkfun.com/products/117> (PRT-00117) Break Away Female Headers - Swiss Machine Pin <https://www.sparkfun.com/products/743> (PRT-00743) Stackable Header - 3 Pin (Female, 0.1") <https://www.sparkfun.com/products/13875> (PRT-13875) For SCREWTERMINALS and SPRING TERMINALS visit here: Screw Terimnals on SparkFun.com <https://www.sparkfun.com/search/results?term=Screw+Terminals> (5mm/3.5mm/2.54mm spacing) This device is also useful as a general connection point to wire up your design to another part of your project. Our various solder wires solder well into these plated through hole pads. Hook-Up Wire - Assortment (Stranded, 22 AWG) <https://www.sparkfun.com/products/11375> (PRT-11375) Hook-Up Wire - Assortment (Solid Core, 22 AWG) <https://www.sparkfun.com/products/11367> (PRT-11367) View the entire wire category on our website here <https://www.sparkfun.com/categories/141> Special notes: Molex polarized connector foot print use with SKU : PRT-08232 with associated crimp pins and housings.; PROD_ID: CONN-10134; SF_SKU: PRT-08433
J13 = JH:XT60PB-F
JP1 = SparkFun-Jumpers:JUMPER-SMT_2_NO: Normally open jumper This jumper has two pads in close proximity to each other. Apply solder to close the connection. Round pads are easier to solder for beginners, but are a lot larger. SparkFun Product that uses the round pads: SparkFun EL Sequencer <https://www.sparkfun.com/products/12781>
SWD = SparkFun-Connectors:CONN_04: Multi connection point. Often used as Generic Header-pin footprint for 0.1 inch spaced/style header connections On any of the 0.1 inch spaced packages, you can populate with these: Break Away Headers - Straight <https://www.sparkfun.com/products/116> (PRT-00116) Break Away Male Headers - Right Angle <https://www.sparkfun.com/products/553> (PRT-00553) Female Headers <https://www.sparkfun.com/products/115> (PRT-00115) Break Away Headers - Machine Pin <https://www.sparkfun.com/products/117> (PRT-00117) Break Away Female Headers - Swiss Machine Pin <https://www.sparkfun.com/products/743> (PRT-00743) For SCREWTERMINALS and SPRING TERMINALS visit here: Screw Terimnals on SparkFun.com <https://www.sparkfun.com/search/results?term=Screw+Terminals> (5mm/3.5mm/2.54mm spacing) This device is also useful as a general connection point to wire up your design to another part of your project. Our various solder wires solder well into these plated through hole pads. Hook-Up Wire - Assortment (Stranded, 22 AWG) <https://www.sparkfun.com/products/11375> (PRT-11375) Hook-Up Wire - Assortment (Solid Core, 22 AWG) <https://www.sparkfun.com/products/11367> (PRT-11367) View the entire wire category on our website here <https://www.sparkfun.com/categories/141> Special notes: Molex polarized connector foot print use with SKU : PRT-08231 with associated crimp pins and housings. 1MM SMD Version SKU: PRT-10208; PROD_ID: CONN-09696
U1 = JH:TPS54X31
U2 = JH:MP245X
U3 = JH:MCP41XXX
U4 U6-U8 = SparkFun-Sensors:LIGHT_SENSOR: Ambient Light Sensors - Phototransistors Low cost ambient light sensors, consisting of a phototransistor in miniature SMD packages. Output voltage varies with light intensity. SparkFun Products ALS-PT19 Light Sensor <https://www.sparkfun.com/products/12566> (SEN-12566) Ambient Light Sensor - TEMT6000 <https://www.sparkfun.com/products/8348> (SEN-08348) SparkFun Ambient Light Sensor Breakout - TEMT60000 <https://www.sparkfun.com/products/8688> (SEN-08688); PROD_ID: IC-11836; SF_ID: SEN-12566
U5 = JH:DRV8833

## Board
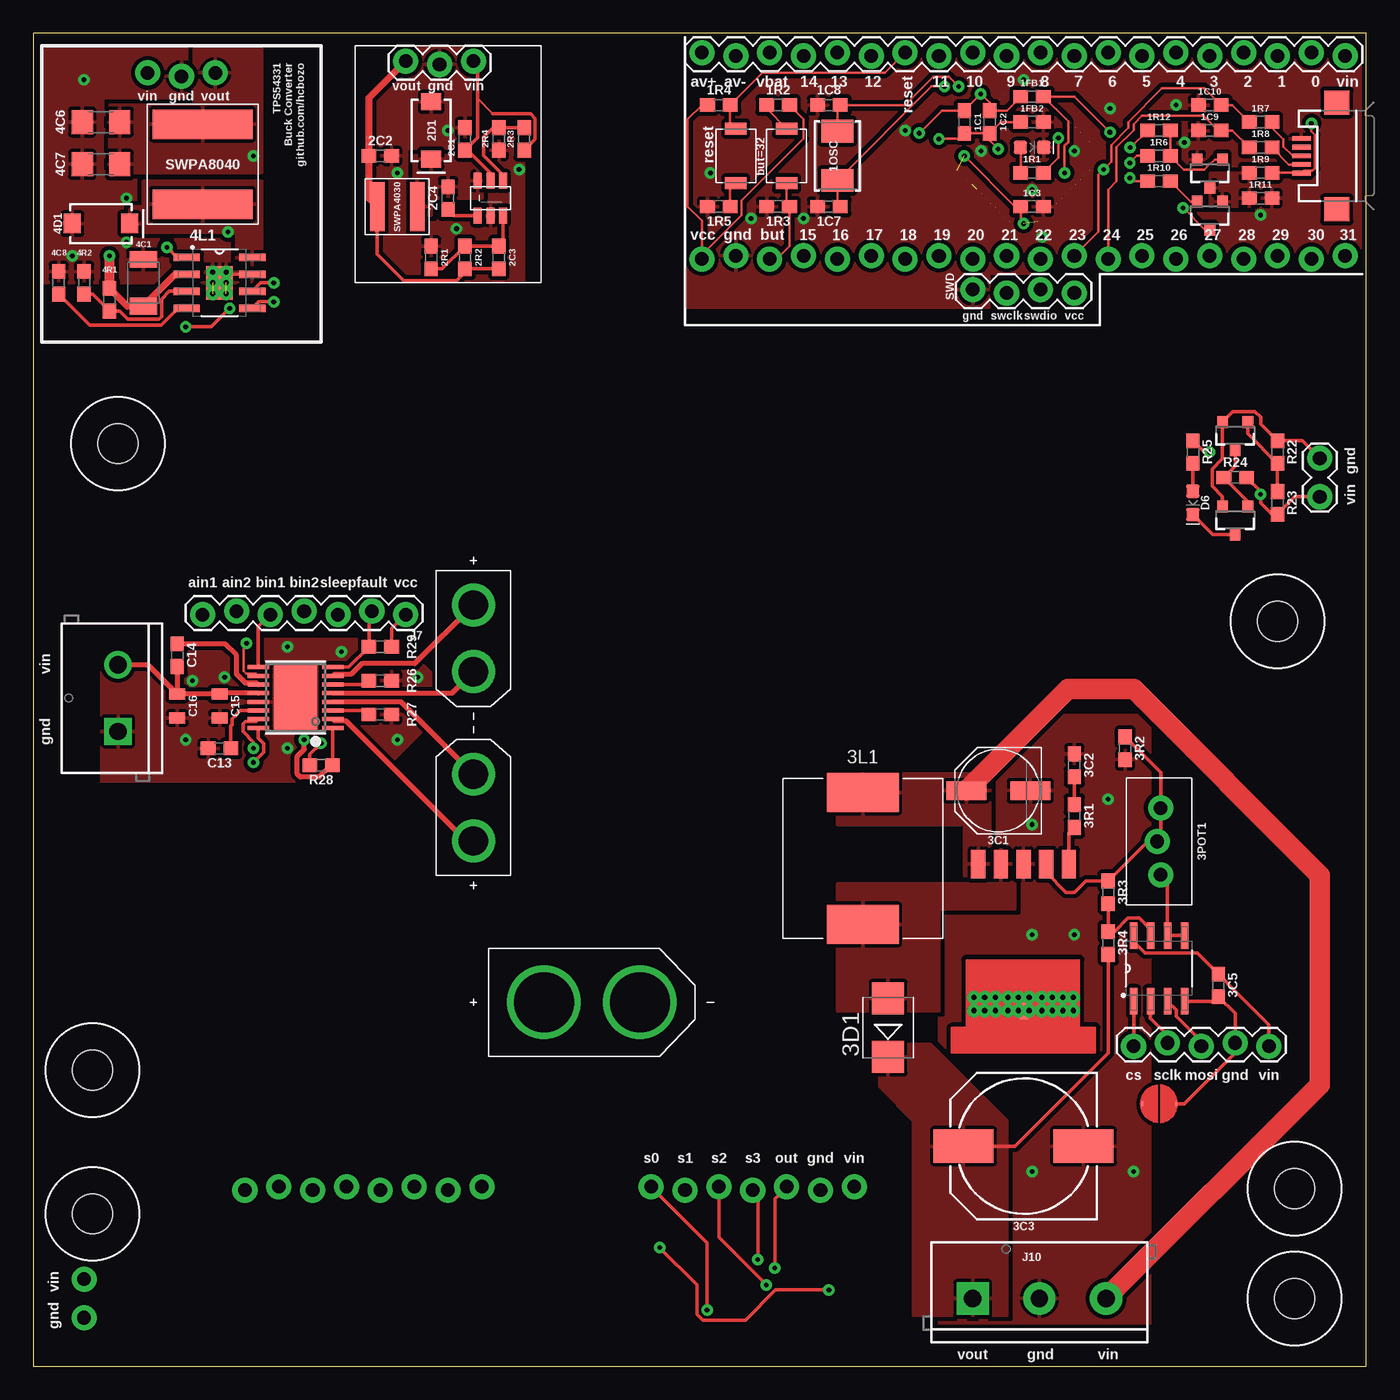
[diagram p3: board, top side]
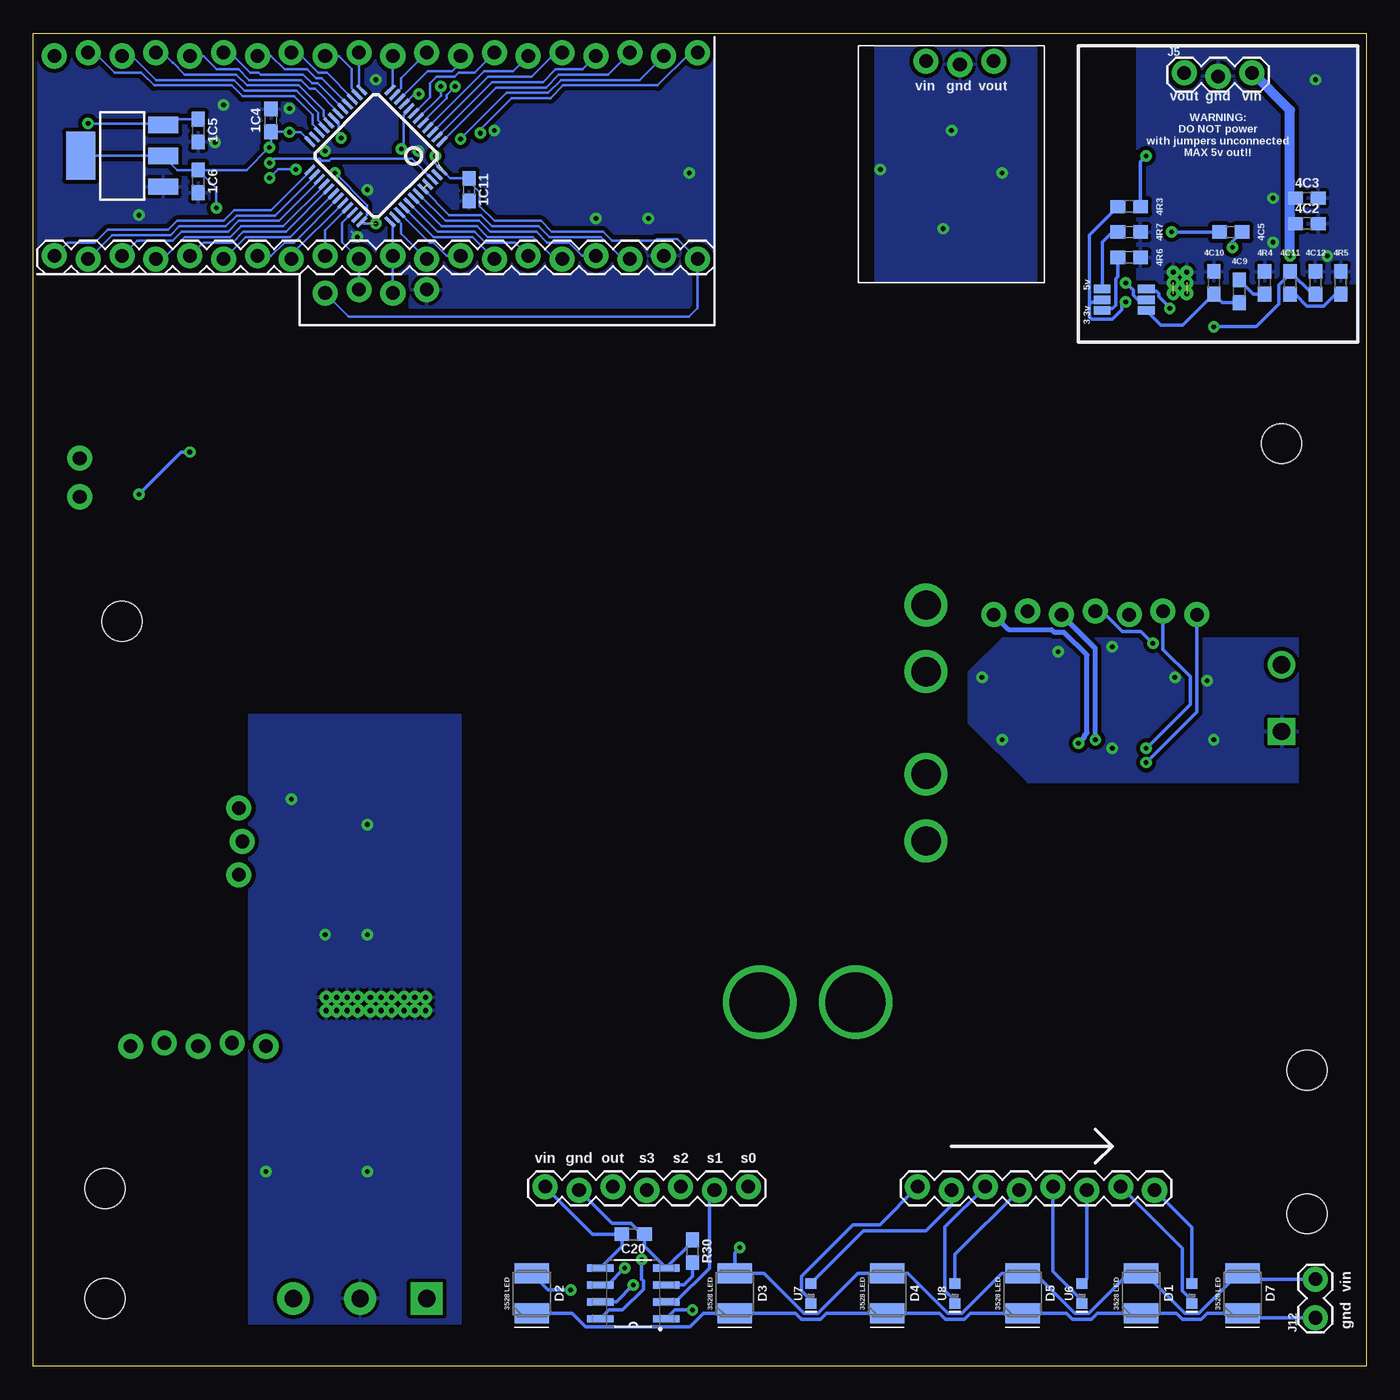
[diagram p4: board, bottom side, seen from below]

Size 100 x 100 mm. Coordinates in mm from the lower left corner, seen from the top.
Outline: 0,0 100,0 100,100 0,100 0,0
Copper layers (1*16): Top 0.035mm / dielectric 1.5mm / Bottom 0.035mm
Design rules "mine *": minimum track width 8mil, minimum drill 10mil, track to track 8mil, track to pad 8mil, pad to pad 8mil, via to via 8mil, smd to smd 8mil, copper to edge 8mil, drill to drill 8mil, minimum pad ring 12mil, minimum via ring 10mil, stop-mask expansion 4mil, vias tented up to drill 25mil, thermal gap 10mil
Holes 3 mm at 94.61,5.08 4.45,11.43 4.45,22.23 94.61,13.34 6.35,69.22 93.34,55.88

### Footprints (pad centres in the part's own frame; a part is rotated, then mirrored left to right if it is on the bottom)
C0603 = smd 1.1 x 1: 1 -0.85,0; 2 0.85,0
LED-0603 = smd 1 x 1: A -0.877,0; C 0.877,0
0603 = smd 1.1 x 1: 1 -0.85,0; 2 0.85,0
USB-MICROB = smd 1.4 x 0.35: D+ -2.65,0; D- -2.65,-0.65; GND -2.65,1.3; ID -2.65,0.65; VBUS -2.65,-1.3 | smd 1.9 x 1.8: MT1 0,-4; MT2 0,4
1X20_LOCK = drill 1.016 pad 1.88: 1 0,0.127; 2 2.54,-0.127; 3 5.08,0.127; 4 7.62,-0.127; 5 10.16,0.127; 6 12.7,-0.127; 7 15.24,0.127; 8 17.78,-0.127; 9 20.32,0.127; 10 22.86,-0.127; 11 25.4,0.127; 12 27.94,-0.127; 13 30.48,0.127; 14 33.02,-0.127; 15 35.56,0.127; 16 38.1,-0.127; 17 40.64,0.127; 18 43.18,-0.127; 19 45.72,0.127; 20 48.26,-0.127
CRYSTAL-SMD-5X3.2-2PAD = smd 1.7 x 2.4: P$1 1.85,0; P$2 -1.85,0
SOT23-3 = smd 0.8 x 0.9: 1 -0.95,-1; 2 0.95,-1; 3 0,1.1
R0603 = smd 1.1 x 1: 1 -0.85,0; 2 0.85,0
3*4-MOMENTARY-SWITCH = smd 0.9 x 1.6: P1 -2.05,0; P2 2.05,0
LQFP48 = smd 0.254 x 1: 1 -2.75,-4.25; 2 -2.25,-4.25; 3 -1.75,-4.25; 4 -1.25,-4.25; 5 -0.75,-4.25; 6 -0.25,-4.25; 7 0.25,-4.25; 8 0.75,-4.25; 9 1.25,-4.25; 10 1.75,-4.25; 11 2.25,-4.25; 12 2.75,-4.25; 25 2.75,4.25; 26 2.25,4.25; 27 1.75,4.25; 28 1.25,4.25; 29 0.75,4.25; 30 0.25,4.25; 31 -0.25,4.25; 32 -0.75,4.25; 33 -1.25,4.25; 34 -1.75,4.25; 35 -2.25,4.25; 36 -2.75,4.25 | smd 1 x 0.254: 13 4.25,-2.75; 14 4.25,-2.25; 15 4.25,-1.75; 16 4.25,-1.25; 17 4.25,-0.75; 18 4.25,-0.25; 19 4.25,0.25; 20 4.25,0.75; 21 4.25,1.25; 22 4.25,1.75; 23 4.25,2.25; 24 4.25,2.75; 37 -4.25,2.75; 38 -4.25,2.25; 39 -4.25,1.75; 40 -4.25,1.25; 41 -4.25,0.75; 42 -4.25,0.25; 43 -4.25,-0.25; 44 -4.25,-0.75; 45 -4.25,-1.25; 46 -4.25,-1.75; 47 -4.25,-2.25; 48 -4.25,-2.75
SOT223 = smd 1.219 x 2.235: 1 -2.311,-3.099; 2 0,-3.099; 3 2.311,-3.099 | smd 3.6 x 2.2: 4 0,3.099
SMA-DIODE = smd 1.27 x 1.47: A -2.15,0; C 2.15,0
SWPA4030 = smd 1.1 x 3.7: P1 -1.5,0; P2 1.5,0
PANASONIC_D = smd 3 x 1.4: + 2.4,0; - -2.4,0
NIC_10X10.5_CAP = smd 4.5 x 2.5: + 4.5,0; - -4.5,0
SMB = smd 2.4 x 2.4: A 2.2,0; C -2.2,0
CDRH127 = smd 5.4 x 2.9: 1 0,4.95; 2 0,-4.95
3296-TRIMPOT = drill 1.016 pad 1.88: 1 -2.5,0.127; 2 0,-0.127; 3 2.5,0.127
TO-263 = smd 2.16 x 1.07: P1 11,-3.4; P2 11,-1.7; P3 11,0; P4 11,1.7; P5 11,3.4 | drill 0.381: P$1 0.008,3.721; P$2 1.008,3.721; P$3 0.008,2.921; P$4 1.008,2.921; P$5 0.008,2.121; P$6 1.008,2.121; P$7 0.008,1.181; P$8 1.008,1.181; P$9 0.008,0.381; P$10 1.008,0.381; P$11 0.008,-0.419; P$12 1.008,-0.419; P$13 0.008,-1.359; P$14 1.008,-1.359; P$15 0.008,-2.159; P$16 1.008,-2.159; P$17 0.008,-2.959; P$18 1.008,-2.959; P$19 0.008,-3.721; P$20 1.008,-3.721 | smd 1.27 x 0.635: TAB 0,0
C1210 = smd 1.27 x 2.06: 1 -1.755,0; 2 1.755,0
C1206 = smd 1.6 x 1.8: 1 -1.4,0; 2 1.4,0
SMT-JUMPER_3_NO_NO-SILK = smd 0.635 x 1.27: 1 -0.813,0; 2 0,0; 3 0.813,0
SWPA8040 = smd 2.2 x 7.5: P1 -3,0; P2 3,0
C0805 = smd 0.8 x 1.2: 1 -0.9,0; 2 0.9,0
SOIC-8 = smd 1.981 x 0.559: 1 -2.464,1.905; 2 -2.464,0.635; 3 -2.464,-0.635; 4 -2.464,-1.905; 5 2.464,-1.905; 6 2.464,-0.635; 7 2.464,0.635; 8 2.464,1.905
3528 = smd 1.5 x 2.6: A -1.5,0; C 1.5,0
1X07_LOCK = drill 1.016 pad 1.88: 1 0,0.127; 2 2.54,-0.127; 3 5.08,0.127; 4 7.62,-0.127; 5 10.16,0.127; 6 12.7,-0.127; 7 15.24,0.127
1X05_LOCK = drill 1.016 pad 1.88: 1 0,0.127; 2 2.54,-0.127; 3 5.08,0.127; 4 7.62,-0.127; 5 10.16,0.127
1X08_LOCK = drill 1.016 pad 1.88: 1 0,0.127; 2 2.54,-0.127; 3 5.08,0.127; 4 7.62,-0.127; 5 10.16,0.127; 6 12.7,-0.127; 7 15.24,0.127; 8 17.78,-0.127
XT30UPB-F = drill 2.2: + -2.5,0; - 2.5,0
1X03_LOCK = drill 1.016 pad 1.88: 1 0,0.127; 2 2.54,-0.127; 3 5.08,0.127
SCREWTERMINAL-5MM-2 = drill 1.3 pad 2.032 square: 1 0,0 | drill 1.3 pad 2.032: 2 5,0
1X02_LOCK = drill 1.016 pad 1.88: 1 -0.178,0; 2 2.718,0
SCREWTERMINAL-5MM-3 = drill 1.3 pad 2.413 square: 1 0,0 | drill 1.3 pad 2.413: 2 5,0; 3 10,0
XT60PB-F = drill 4.5: + -3.6,0; - 3.6,0
SMT-JUMPER_2_NO_NO-SILK_ROUND = smd 0.152 x 0.305: 1 -1.27,0; 2 1.27,0
1X04_LOCK = drill 1.016 pad 1.88: 1 0,0.127; 2 2.54,-0.127; 3 5.08,0.127; 4 7.62,-0.127
POWERPAD-SOIC-8 = smd 1.981 x 0.559: 1 -2.464,1.905; 2 -2.464,0.635; 3 -2.464,-0.635; 4 -2.464,-1.905; 5 2.464,-1.905; 6 2.464,-0.635; 7 2.464,0.635; 8 2.464,1.905 | smd 2.007 x 2.489: 9 0,0 | drill 0.381: P$1 -0.5,0.8; P$2 0.5,0.8; P$3 -0.5,0; P$4 0.5,0; P$5 -0.5,-0.8; P$6 0.5,-0.8
SOT23-6-MP = smd 0.6 x 1.2: P1 -0.95,-1.3; P2 0,-1.3; P3 0.95,-1.3; P4 0.95,1.3; P5 0,1.3; P6 -0.95,1.3
ALS-PT19 = smd 0.8 x 0.8: C -0.75,0; E 0.75,0
SSOP16 = smd 0.3 x 1.6: 1 -2.275,-2.8; 2 -1.625,-2.8; 3 -0.975,-2.8; 4 -0.325,-2.8; 5 0.325,-2.8; 6 0.975,-2.8; 7 1.625,-2.8; 8 2.275,-2.8; 9 2.275,2.8; 10 1.625,2.8; 11 0.975,2.8; 12 0.325,2.8; 13 -0.325,2.8; 14 -0.975,2.8; 15 -1.625,2.8; 16 -2.275,2.8 | smd 4.8 x 3.2: PPAD 0,0

### Placement (x,y rotation side)
1C1  69.85,93.34 270 top
1C2  71.75,93.34 270 top
1C3  74.93,87 0 top
1C4  82.17,93.47 90 bottom
1C5  87.63,92.71 270 bottom
1C6  87.63,88.9 270 bottom
1C7  59.69,87 180 top
1C8  59.69,94.61 180 top
1C9  88.27,92.71 0 top
1C10  88.27,94.61 0 top
1C11  67.31,88.27 270 bottom
1D1  74.93,91.44 0 top
1FB1  74.93,95.25 180 top
1FB2  74.93,93.34 180 top
1J1  97.79,90.81 0 top
1J2  98.42,98.42 180 top
1J3  50.16,83.19 180 bottom
1OSC  60.33,90.81 90 top
1Q1  88.27,89.53 180 top
1Q2  88.27,86.36 180 top
1R1  74.93,89.53 0 top
1R2  55.88,94.61 0 top
1R3  55.88,87 0 top
1R4  51.44,94.61 180 top
1R5  51.44,87 0 top
1R6  84.45,90.81 0 top
1R7  92.08,93.34 0 top
1R8  92.08,91.44 0 top
1R9  92.08,89.53 0 top
1R10  84.45,88.9 0 top
1R11  92.08,87.63 180 top
1R12  84.45,92.71 180 top
1S1  56.52,90.81 270 top
1S2  52.7,90.81 90 top
1U1  74.3,90.81 135 bottom
1U2  93.34,90.81 90 bottom
2C1  32.38,92.08 90 top
2C2  26.04,90.81 0 top
2C3  34.92,83.19 90 top
2C4  31.11,87.63 90 top
2D1  29.84,92.71 270 top
2L1  27.3,87 180 top
2R1  29.84,83.19 270 top
2R2  32.38,83.19 270 top
2R3  36.83,92.08 90 top
2R4  34.92,92.08 90 top
3C1  72.39,43.18 180 top
3C2  78.11,45.09 90 top
3C3  74.3,16.51 180 top
3C5  88.9,28.57 270 top
3D1  64.14,25.4 90 top
3L1  62.23,38.1 0 top
3POT1  84.45,39.37 270 top
3R1  78.11,41.27 270 top
3R2  81.92,46.35 90 top
3R3  80.64,35.56 270 top
3R4  80.64,31.75 270 top
3U1  74.3,26.67 90 top
4C1  8.26,81.28 90 top
4C2  4.45,85.72 0 bottom
4C3  4.45,87.63 0 bottom
4C5  10.16,85.09 180 bottom
4C6  5.08,93.34 180 top
4C7  5.08,90.17 180 top
4C8  1.91,81.28 90 top
4C9  9.53,80.64 90 bottom
4C10  11.43,81.28 90 bottom
4C11  5.71,81.28 270 bottom
4C12  3.81,81.28 90 bottom
4D1  5.08,85.72 0 top
4JP1  16.51,80.01 90 bottom
4JP2  19.81,80.01 90 bottom
4L1  12.7,90.17 90 top
4R1  5.71,80.01 90 top
4R2  3.81,81.28 270 top
4R3  17.78,87 0 bottom
4R4  7.62,81.28 90 bottom
4R5  1.91,81.28 90 bottom
4R6  17.78,83.19 180 bottom
4R7  17.78,85.09 180 bottom
C13  13.97,46.35 180 top
C14  10.79,53.34 270 top
C15  13.97,49.53 270 top
C16  10.79,49.53 270 top
C20  54.99,9.91 180 bottom
CS1  54.99,5.46 180 bottom
D1  16.89,5.46 270 bottom
D2  62.61,5.46 270 bottom
D3  47.37,5.46 270 bottom
D4  35.94,5.46 270 bottom
D5  25.78,5.46 270 bottom
D6  87,64.77 270 top
D7  9.27,5.46 270 bottom
J1  61.59,13.34 0 bottom
J2  92.71,24.13 180 top
J3  15.88,13.34 180 bottom
J4  33.02,41.91 90 top
J5  13.65,96.9 0 bottom
J6  33.02,54.61 270 top
J7  27.94,56.52 180 top
J8  6.35,47.62 90 top
J9  96.52,67.94 270 top
J10  70.48,5.08 0 top
J11  27.94,97.79 0 top
J12  3.81,3.81 90 bottom
J13  41.91,27.3 0 top
JP1  84.45,19.68 0 top
Q3  90.17,69.85 180 top
Q4  90.17,63.5 180 top
R22  93.34,68.58 270 top
R23  93.34,64.77 270 top
R24  90.17,66.67 0 top
R25  87,68.58 270 top
R26  26.04,51.44 180 top
R27  26.04,48.9 180 top
R28  21.59,45.09 180 top
R29  26.04,53.98 0 top
R30  50.55,8.64 270 bottom
SWD  70.48,80.64 0 top
U1  13.97,81.28 0 top
U2  34.29,87.63 0 top
U3  84.45,29.84 90 top
U4  13.08,5.46 90 bottom
U5  19.68,50.16 90 top
U6  21.34,5.46 90 bottom
U7  41.66,5.46 90 bottom
U8  30.86,5.46 90 bottom

### Tracks (layer width: path | path; a pad name or v marks a point on that pad's centre or on a via)
0  (1 unrouted)
  Bottom 0.203: 1U1.22 78.54,92.67 79.04,93.17 79.04,93.88 80.43,95.28 84.3,95.28 85.11,96.09 90.95,96.09 91.91,97.05 93.88,97.05 95.38,98.55 1J2.2
1  (1 unrouted)
  Bottom 0.203: 1U1.21 78.18,93.02 78.63,93.47 78.63,94.05 80.26,95.68 84.13,95.68 84.94,96.5 90.78,96.5 92.58,98.3 1J2.3
2  (1 unrouted)
  Bottom 0.203: 1U1.20 77.83,93.38 78.22,93.77 78.22,94.22 80.09,96.09 83.96,96.09 84.78,96.9 88.63,96.9 89.52,97.79 89.53,97.79 90.3,98.55 1J2.4
3  (1 unrouted)
  Bottom 0.203: 1U1.18 77.12,94.08 78.87,95.83 79.26,95.83 79.92,96.5 83.8,96.5 84.61,97.31 86.24,97.31 87.23,98.3 1J2.5
4  (1 unrouted)
  Bottom 0.203: 1U1.17 78.67,96.24 79.1,96.24 79.76,96.9 82.93,96.9 83.08,97.05 83.72,97.05 85.22,98.55 1J2.6
5  (1 unrouted)
  Bottom 0.203: 1J2.7 82.15,98.3 81.16,97.31 79.45,97.31 78.79,96.65 78.37,96.65 1U1.16
6  (1 unrouted)
  Bottom 0.203: 1U1.15 76.06,95.14 77.97,97.05 78.62,97.05 80.12,98.55 1J2.8
7  (1 unrouted)
  Bottom 0.203: 1U1.14 75.71,95.5 76.1,95.89 76.1,97.33 77.07,98.3 1J2.9
8  (1 unrouted)
  Bottom 0.203: 1U1.13 75.56,95.96 1J2.10
9  (1 unrouted)
  Bottom 0.203: 1U1.12 73.03,95.96 1J2.11
10  (1 unrouted)
  Bottom 0.203: 1U1.11 72.39,95.89 72.39,96.65 1J2.12
11  (1 unrouted)
  Bottom 0.203: 1U1.10 70.42,97.16 68.58,97.16 67.94,97.79 1J2.13
12  (1 unrouted)
  Bottom 0.203: 1U1.4 66.18,97.16 64.01,97.16 1J2.15
13  (1 unrouted)
  Bottom 0.203: 1U1.3 65.88,96.75 62.64,96.75 60.83,98.55 1J2.16
14  (1 unrouted)
  Bottom 0.203: 1U1.2 65.58,96.34 61.77,96.34 60.81,97.31 58.78,97.31 1J2.17
15  (1 unrouted)
  Bottom 0.203: 1U1.43 69.06,85.93 66.55,85.93 65.74,85.11 62.26,85.11 61.44,84.3 59.81,84.3 58.82,83.31 1J3.4
16  (1 unrouted)
  Bottom 0.203: 1U1.42 69.36,85.52 66.72,85.52 65.91,84.71 62.5,84.71 60.85,83.06 1J3.5
17  (1 unrouted)
  Bottom 0.203: 1U1.41 69.67,85.11 66.89,85.11 66.08,84.3 63.86,84.3 1J3.6
18  (1 unrouted)
  Bottom 0.203: 1U1.40 69.97,84.71 67.06,84.71 1J3.7
19  (1 unrouted)
  Bottom 0.203: 1U1.39 70.27,84.3 69.97,84.3 68.98,83.31 1J3.8
20  (1 unrouted)
  Bottom 0.203: 1U1.38 72.39,85.72 72.39,84.96 1J3.9
21  (1 unrouted)
  Bottom 0.203: SWD.2 1J3.10 73.03,85.65 1U1.37
22  (1 unrouted)
  Bottom 0.203: SWD.3 1J3.11 76.83,84.33 76.83,85.79 1U1.34
23_USBDP  (via drill 0.35)  (1 unrouted)
  Top 0.203: 1R7.1 89.95,94.61 1C10.2 87.84,95.89 84.69,95.89 82.14,93.34 82.14,92.9 80.86,91.62 80.86,90.36 v80.29,89.79 79.91,89.41 79.91,85.12 1J3.12 | 1R10.1 82.52,88.9 v82.27,89.15
  Bottom 0.203: v82.27,89.15 81.63,89.79 v80.29,89.79 | 1U1.33 78.11,85.23 1J3.12
24_USBDM  (1 unrouted)
  Top 0.203: 1R8.1 89.95,92.71 1C9.2 88.9,92.71 87.8,93.81 83.19,93.81 82.55,93.17 82.55,92.73 81.27,91.45 81.27,88.89 80.64,88.27 1J3.13
  Bottom 0.203: 1U1.32 80.64,83.39 1J3.13
25  (1 unrouted)
  Bottom 0.203: 1J3.14 82.15,83.31 81.16,84.3 80.44,84.3 1U1.31
26  (1 unrouted)
  Bottom 0.203: 1J3.15 84.07,84.71 80.75,84.71 1U1.30
27  (1 unrouted)
  Bottom 0.203: 1J3.16 87.27,84.3 85.06,84.3 84.24,85.11 81.05,85.11 1U1.29
28  (1 unrouted)
  Bottom 0.203: 1U1.28 78.18,88.59 81.25,85.52 84.41,85.52 85.22,84.71 88.63,84.71 90.28,83.06 1J3.17
29  (1 unrouted)
  Bottom 0.203: 1U1.27 78.54,88.94 81.55,85.93 84.58,85.93 85.39,85.11 88.88,85.11 89.53,84.45 92.2,84.45 1J3.18
30  (1 unrouted)
  Bottom 0.203: 1U1.26 78.89,89.29 81.85,86.33 84.75,86.33 85.56,85.52 89.04,85.52 89.7,84.86 94.08,84.86 1J3.19
31  (1 unrouted)
  Bottom 0.203: 1U1.25 79.25,89.65 82.15,86.74 84.92,86.74 85.73,85.93 89.21,85.93 89.87,85.27 94.44,85.27 95.4,84.3 97.43,84.3 1J3.20
32  (2 unrouted)
  Top 0.203: 1J3.3 55.75,83.06 56.73,84.03 1R3.2 56.52,87.21 1S1.P2
  Bottom 0.203: 1U1.45 1U1.44 68.79,86.36 66.41,86.36 65.57,85.52 62.09,85.52 61.27,84.71 57.42,84.71 55.77,83.06 1J3.3
33  (via drill 0.35)  (1 unrouted)
  Top 0.203: v76.91,92.15 76.91,90.66 1R1.2
  Bottom 0.203: 1U1.19 77.48,93.6 77.08,93.2 77.08,92.32 v76.91,92.15
AGND  (via drill 0.35)  (1 unrouted)
  Top 0.203: 1C2.2 1C1.2 69.43,92.08 v67.94,92.08 | v72.39,91.31 71.75,91.95 1C2.2 | 1C2.2 72.61,93.34 1FB2.2
  Bottom 0.203: 1U1.8 71.82,94.24 72.22,93.85 72.22,91.49 v72.39,91.31 | 1J2.19 54.51,96.5 60.41,96.5 61.38,95.53 64.49,95.53 v67.94,92.08
COMP  (via drill 0.35)
  Top 0.254: U1.6 17.07,81.28 v18.03,81.28
  Bottom 0.254: v18.03,81.28 17.48,80.72 17.48,80.37 17.12,80.01 4JP1.2
DISC  (via drill 0.35)  (1 unrouted)
  Top 0.203: 1R6.1 82.8,90.81 v82.27,90.27
  Bottom 0.203: v82.27,90.27 81.96,90.58 78.54,90.58 78.41,90.45 77.8,90.45 77.67,90.58 71.59,90.58 1U1.46
FDBK
  Top 0.254: 3R2.2 84.58,44.54 3POT1.1 84.58,39.62 3POT1.2 83.61,39.37 3R3.1 78.95,36.41 78.11,35.56 77.47,35.56 76,37.03 3U1.P2
GND  (via drill 0.35)
  Bottom 0.203: 76.1,85.12 v75.69,84.71
  other vias: 74.93,88.27 53.85,86.11 57.78,86.11 50.8,89.53 71.12,91.19 92.08,86.36 86.36,91.82 85.72,94.61 80.77,94.36 78.11,91.19 74.3,96.52 65.41,92.71
  pour Top (isolate 0.305, rank 6): 99.69,99.69 48.9,99.69 48.9,79.38 71.75,79.38 71.75,81.92 99.69,81.92
  pour Bottom (isolate 0.305, rank 6): 48.9,99.69 99.69,99.69 99.69,81.92 71.75,81.92 71.75,79.38 48.9,79.38
GND-BOOST  (via drill 0.35)
  other vias: 74.93,14.61 82.55,14.61 78.11,32.38 74.93,32.38 74.93,40.64 80.64,42.55
  pour Top (isolate 0.305, rank 4): 67.94,3.17 67.94,48.9 83.82,48.9 83.82,3.17
  pour Bottom (isolate 0.305, rank 4): 67.94,48.9 67.94,3.17 83.82,3.17 83.82,48.9
GND-BUCK  (via drill 0.35)
  other vias: 36.45,89.79 27.3,89.53 31.75,85.34 31.11,92.71
  pour Top (isolate 0.305, rank 6): 36.83,81.28 24.77,81.28 24.77,99.06 36.83,99.06
  pour Bottom (isolate 0.305, rank 6): 24.77,81.28 36.83,81.28 36.83,99.06 24.77,99.06
GND-CS
  Bottom 0.254: R30.1 50.55,9.35 CS1.4 54.14,8.98 C20.1 54.32,9.91 55.15,10.74 56.58,10.74 J1.2
GND-ISO  (via drill 0.35)  (2 unrouted)
  Top 0.254: U1.9 14.61,81.92 U1.7
  other vias: 2.92,83.31 6.99,84.33 6.99,87.63 3.81,96.52
  pour Bottom (isolate 0.305, rank 5): 0.64,99.06 17.14,99.06 17.14,81.28 0.64,81.28
  pour Top (isolate 0.305, rank 5): 0.64,99.06 17.14,99.06 17.14,81.28 0.64,81.28
GND-LED
  Top 0.254: J9.1 95.21,69.43 R22.1 92.08,70.7 92.08,71.21 91.66,71.63 90,71.63 Q3.2 89.22,68.09 88.44,67.31 88.44,66.04 89.22,65.26 Q4.2
GND-MOTOR  (via drill 0.35)
  other vias: 11.43,46.99 19.05,46.35 27.3,46.99 28.83,51.69 19.05,53.98 11.94,51.44 14.35,51.69 23.11,53.59
  pour Top (isolate 0.305, rank 4): 29.84,52.07 29.84,48.26 25.4,43.81 5.08,43.81 5.08,54.61 27.3,54.61
  pour Bottom (isolate 0.305, rank 4): 29.84,52.07 29.84,48.26 25.4,43.81 5.08,43.81 5.08,54.61 27.3,54.61
GND-POT
  Top 0.254: JP1.2 86.36,19.68 90.17,23.5 J2.2 90.17,26.45 3C5.2 88.56,27.38 U3.4
N$1
  Top 0.203: 1S1.P1 55.03,94.34 1R2.1
N$2
  Top 0.203: 1D1.A 74.08,91.41 1R1.1
N$3
  Top 0.254: U2.P3 35.24,84.35 2C3.2 2R2.1 30.68,82.33 2R1.2
N$4
  Top 0.203: 1R5.2 52.28,88.33 1S2.P1
N$5
  pour Top (isolate 0.305): 33.66,87.63 33.66,90.81 28.57,90.81 28.57,86.36 29.84,86.36 29.84,87.63
N$6
  Top 0.254: 2C4.1 31.57,86.33 U2.P1
N$7  (via drill 0.35)
  Top 0.254: v59.69,5.71 55.68,5.71 53.43,3.46 50.23,3.46 49.79,3.9 49.79,6.09 v46.99,8.89
  Bottom 0.254: J12.2 8.84,6.53 D7.A 9.56,6.96 12.54,3.98 13.62,3.98 16.6,6.96 D1.A 17.82,6.96 20.8,3.98 21.87,3.98 24.85,6.96 D5.A 27.34,6.96 30.32,3.98 31.4,3.98 34.38,6.96 D4.A 38.14,6.96 41.12,3.98 42.19,3.98 45.17,6.96 D3.A 47.37,8.51 v46.99,8.89 | v59.69,5.71 61.37,5.71 D2.A
N$8
  Top 0.254: U1.4 10.88,79.38 9.61,78.1 4.23,78.1 4C8.1
N$9  (via drill 0.35)
  Top 0.254: v10.03,83.95 10.79,83.19 U1.1
  Bottom 0.254: 4C5.1 10.03,84.37 v10.03,83.95
N$10  (via drill 0.35)
  Bottom 0.254: 4C5.2 v14.61,85.09
  pour Top (isolate 0.305, rank 2): 6.99,85.09 15.24,85.09 15.24,82.55 17.14,82.55 17.14,88.9 8.26,88.9 8.26,87 6.99,87
N$11
  Top 0.254: U1.3 10.2,80.64 9.62,80.06 9.62,78.75 9.42,78.56 7.09,78.56 6.49,79.16 4R1.1 4.45,80.43 4R2.2
N$12
  Bottom 0.254: 4C9.2 8.46,80.43 4R4.1
N$13
  Bottom 0.254: J12.1 8.94,3.63 D7.C 11.92,3.96 12.36,3.52 13.81,3.52 14.24,3.96 D1.C 20.17,3.96 20.61,3.52 22.06,3.52 22.5,3.96 D5.C 29.7,3.96 30.14,3.52 31.59,3.52 32.02,3.96 D4.C 40.49,3.96 40.93,3.52 42.38,3.52 42.82,3.96 D3.C 49.73,3.96 50.74,2.95 58.58,2.95 59.6,3.96 D2.C
N$14
  Bottom 0.254: U4.C 13.08,4.94 13.81,5.67 13.81,8.86 J3.2
N$15
  Bottom 0.254: 4JP1.1 15.42,78.11 13.76,78.11 4C10.1 10.79,79.8 4C9.1
N$16
  Top 0.254: 3POT1.3 85.09,36.36 U3.6 U3.5
N$17
  Bottom 0.254: U4.E 13.08,10.41 J3.1
N$18
  Top 0.254: U3.7 83.82,32.78 82.97,33.63 82.13,33.63 81.1,32.6 3R4.1 3R3.2
N$19
  Bottom 0.254: U6.C 21.34,4.94 23.5,7.1 J3.4
N$20
  Top 0.254: 2R3.2 2R4.2 34.51,92.92 33.78,92.2 33.78,90.81 35.24,89.35 U2.P4
N$21
  Top 0.254: Q3.3 90.17,67.53 R24.1 91.12,64.88 Q4.1
N$22
  Top 0.254: U3.3 85.75,26.72 85.75,26.25 87.63,24.37 J2.3
N$23
  Top 0.254: U3.2 83.82,26.11 85.09,24.84 J2.4
N$24
  Top 0.254: U3.1 J2.5
N$25
  Top 0.254: R25.2 D6.A
N$26
  Top 0.254: D6.C 88.49,62.4 Q4.3
N$27  (via drill 0.35)
  Top 0.254: U5.16 16.89,47.12 17.27,46.73 17.27,46.04 16.82,45.6 16.81,45.6 v16.51,45.29
  Bottom 0.254: v16.51,45.29 16.21,45.6 16.2,45.6 12.7,49.09 J7.7
N$28
  Top 0.254: Q3.1 91.12,69.95 R22.2 R23.1
N$29  (via drill 0.35)
  Top 0.254: U5.15 16.71,48.37 15.95,48.37 15.76,48.18 15.76,47.6 16.51,46.85 v16.51,46.35
  Bottom 0.254: J7.6 15.24,53.78 13.21,51.75 13.21,49.65 v16.51,46.35
N$30
  Top 0.254: U5.9 16.89,55.49 J7.5
N$31  (via drill 0.35)
  Top 0.203: 15.81,54.04 15.78,54.01 15.78,52.16 15.96,51.98 16.69,51.98 U5.10
  Top 0.254: 15.81,54.04 v16,54.23
  Bottom 0.254: v16,54.23 16.89,55.12 18.31,55.12 19.83,56.64 J7.4
N$32  (via drill 0.35)
  Top 0.254: R28.1 22.44,47.84 U5.1
  Top 0.381: R28.1 22.35,45.09 21.45,44.19 20.03,44.19 19.8,44.42 19.8,45.75 20.32,46.27 v20.32,46.99
  Bottom 0.381: v20.32,46.99 20.32,53.85 J7.3
N$33
  Top 0.254: U5.8 23.65,52.44 R29.1 25.18,56.43 J7.2
N$34
  pour Top (isolate 0.305): 73.66,38.73 72.39,38.73 72.39,36.2 60.33,36.2 60.33,26.67 67.94,26.67 67.94,34.29 73.66,34.29
N$35
  Top 0.254: R26.2 24.89,51.14 U5.6
N$36
  Top 0.254: 3U1.P1 77.69,40.02 3R1.2
N$37
  Top 0.254: 3R1.1 3C2.1
N$38
  Top 0.254: U5.3 24.89,49.19 R27.2
N$39
  Top 0.381: U5.2 22.59,48.43 23.45,48.43 32.47,39.41 J4.+
N$40
  Top 0.381: J4.- 27.59,49.84 U5.4
N$41
  Top 0.381: J6.+ 28.61,52.7 24.65,52.7 23.84,51.9 22.59,51.9 U5.7
N$42
  Top 0.381: U5.5 31.4,50.49 J6.-
N$43
  Top 0.381: U5.11 16.78,51.25 15.92,51.25 15.24,51.93 15.24,53.34 14.39,54.19 C14.1
N$44
  Top 0.254: U5.14 15.54,49.19 14.9,48.55 14.9,48.09 14.82,48.01 C13.1
N$45  (via drill 0.35)
  Top 0.254: v50.55,4.22 50.55,9.27 J1.7
  Bottom 0.254: CS1.1 51.87,4.22 v50.55,4.22
N$46
  Bottom 0.254: J1.6 49.28,12.83 49.28,7.35 51.8,4.83 CS1.2
N$47  (via drill 0.35)
  Top 0.254: v54.99,6.1 51.44,9.65 J1.5
  Bottom 0.254: CS1.7 56.26,4.83 v54.99,6.1
N$48  (via drill 0.35)
  Top 0.254: v54.36,8 54.36,12.83 J1.4
  Bottom 0.254: CS1.8 56.79,4.22 55.8,4.22 54.23,5.78 54.23,6.41 54.36,6.54 v54.36,8
N$49  (via drill 0.35)
  Top 0.254: v55.63,7.37 55.63,12.57 J1.3
  Bottom 0.254: CS1.6 56.9,6.1 v55.63,7.37
N$50
  Bottom 0.254: CS1.3 51.18,6.1 50.55,6.73 R30.2
N$51
  Top 0.203: 1R10.2 86.84,87.36 1Q2.2
N$52
  Bottom 0.254: 4R5.1 2.29,80.43 3.17,79.55 4.45,79.55 5.33,80.43 4C11.2
N$54  (via drill 0.35)
  Top 0.254: v14.73,79.37 13.34,77.98 v11.43,77.98
  Bottom 0.254: 4C12.1 4.01,80.43 4C11.1 5.71,81.95 6.54,81.12 6.54,79.69 8.26,77.98 v11.43,77.98 | 4JP1.3 16.34,80.66 15.74,80.66 15.54,80.46 15.54,80.24 14.73,79.43 v14.73,79.37
N$56
  Bottom 0.254: U6.E 20.95,6.59 J3.3
N$57
  Bottom 0.254: 4JP2.1 19.65,79.36 19.04,79.36 18.79,79.61 18.79,81.59 18.63,81.76 4R6.2
N$58
  Bottom 0.254: 4JP2.3 19.81,84.33 19.05,85.09 4R7.2
N$59
  Top 0.203: 1R8.2 94.21,90.16 1J1.D-
N$60
  Top 0.203: 1R7.2 92.92,92.92 93.78,92.07 93.78,91.51 94.48,90.81 1J1.D+
N$61
  Bottom 0.254: J3.8 36.5,10.62 38.52,10.62 42.39,6.75 42.39,5.67 41.66,4.95 41.66,4.94 U7.C
N$62
  Bottom 0.254: U7.E 37.71,10.16 33.02,10.16 31.11,12.06 J3.7
N$63
  Bottom 0.254: U8.E 30.86,8.38 J3.5
N$64
  Bottom 0.254: U8.C 30.86,4.94 31.59,5.67 31.59,10.45 J3.6
N$71
  pour Top (isolate 0.305): 91.44,89.53 88.27,89.53 88.27,87 91.44,87
N$73
  Top 0.203: 1R12.1 1R6.2 86.33,89.78 87.84,89.78 88.23,90.17 88.27,90.17 88.63,90.53 1Q1.1
OSC_IN  (via drill 0.35)  (1 unrouted)
  Top 0.203: 1C7.1 60.33,87.21 1OSC.P$2 67.39,96.02 v68.36,96.02
  Bottom 0.203: v68.36,96.02 69.01,95.36 69.01,95.12 70.76,93.38 1U1.5
OSC_OUT  (via drill 0.35)  (1 unrouted)
  Top 0.203: 1OSC.P$1 60.33,94.4 1C8.1 65.41,94.61 67.54,96.75 68.68,96.75 v69.42,96.02
  Bottom 0.203: 1U1.6 69.42,95.33 v69.42,96.02
RESET  (1 unrouted)
  Top 0.203: 1S2.P2 52.28,93.28 1R4.1 54.72,97.05 63.91,97.05 1J2.14
  Bottom 0.203: 1J2.14 66.9,97.05 68.11,97.05 68.41,96.75 69.75,96.75 70.23,96.27 70.23,95.22 1U1.7
V_USB  (via drill 0.35)
  Top 0.203: 1R9.2 95.11,89.53 1J1.VBUS 95.31,89.67 95.97,89.67 96.14,89.85 96.14,92.41 95.89,92.67 v95.89,93.24
  Bottom 0.203: 1C5.1 89.8,93.56 1U2.3 90.37,93.24 v95.89,93.24
VBAT  (1 unrouted)
  Bottom 0.203: 1U1.1 65.28,95.94 61.54,95.94 60.58,96.9 56.9,96.9 1J2.18
VCC  (via drill 0.35)  (3 unrouted)
  Top 0.203: v74.3,85.72 74.08,85.94 1C3.1 73.66,87 v69.85,90.81 | 1Q2.3 87.91,85.26 v86.27,86.9 | v82.3,91.44 82.33,91.44 1R12.2 | 1R4.2 50.16,94.61 49.09,93.55 49.09,87 50.16,85.93 1J3.1 50.16,83.39 53.14,86.37 53.14,87.43 57.78,92.08 57.78,93.56 1R2.2 | v80.77,92.58 78.11,95.25 1FB1.1 77.64,93.39 77.64,91.84 77.37,91.57 v77.37,89.53
  Bottom 0.203: 1C6.1 89.19,89.75 1U2.2 1U2.4 | v74.3,85.72 75.22,85.72 1U1.36 75.36,85.95 74.96,86.35 74.96,87.12 v77.37,89.53 | v86.27,86.9 86.27,88.39 1C6.1 | 1C6.1 83.99,89.75 v82.3,91.44 82.17,91.57 1C4.1 80.81,92.62 v80.77,92.58 79.96,92.58 1U1.24 | SWD.4 76.33,78.74 50.8,78.74 50.16,79.38 1J3.1 51.66,84.56 53.22,84.56 53.32,84.45 56.59,84.45 57.25,85.11 61.11,85.11 61.92,85.93 65.4,85.93 66.5,87.03 66.5,88.09 67.31,88.9 1C11.1 68.72,89.11 69.85,90.25 v69.85,90.81
VCC-MOTOR  (via drill 0.35)
  Top 0.254: R29.2 26.89,55.33 J7.1 | v21.59,46.74 20.74,45.89 R28.2
  Bottom 0.254: 27.69,56.13 J7.1
  Bottom 0.381: v21.59,46.74 21.14,47.18 21.14,47.33 20.95,47.52 20.95,53.34 22.67,55.05 23.41,55.05 23.6,55.24 26.8,55.24 27.69,56.13
VCCA  (via drill 0.35)  (1 unrouted)
  Top 0.203: v66.47,92.51 68.16,94.19 1C1.1 69.85,94.23 v71.08,95.46 71.75,94.78 1C2.1 73.03,94.19 1FB1.2
  Bottom 0.203: 1U1.9 71.41,95.46 v71.08,95.46 | 1J2.20 50.69,98.55 53.16,96.09 60.24,96.09 61.21,95.12 64.14,95.12 66.47,92.78 v66.47,92.51
VIN  (via drill 0.35)
  Top 0.508: U1.2 10.64,81.92 4C1.1 7.05,79.53 4R1.2
  Top 0.762: 4R1.2 v5.71,83.31
  Bottom 0.203: 5.71,88.9 5.71,88.05 4C3.1 | 5.71,86.36 5.71,86.14 4C2.1
  Bottom 0.762: v5.71,83.31 5.71,86.36 5.71,88.9 5.71,94.23 8.51,97.03 J5.3
VIN-BOOST
  Top 1.524: J10.3 96.52,21.11 96.52,36.83 82.55,50.8 77.61,50.8 3C1.+
  pour Top (isolate 0.305): 71.75,36.83 71.75,44.45 60.33,44.45 60.33,40.64 69.85,40.64 69.85,36.83
VIN-BUCK
  Top 0.203: 34.46,93.98 33.33,95.12 33.33,95.25
  Top 0.254: U2.P5 34.29,89.52 32.59,91.22 2C1.1 33.33,92.17 33.33,95.25 33.33,97.61 J11.3 | 2R3.1 37.66,92.06 37.66,93.61 37.29,93.98 34.46,93.98
VIN-CS
  Bottom 0.254: J1.1 58.04,9.91 C20.2 55.84,8.98 CS1.5
VIN-LED  (via drill 0.35)
  Top 0.254: R24.2 92.08,65.62 v92.08,65.41 92.08,64.77 92.92,63.92 R23.2 94.65,65.23 J9.2 | R25.1 87.84,68.58 v88.27,68.58
  Bottom 0.254: v88.27,68.58 88.9,68.58 v92.08,65.41
VIN-MOTOR
  Top 0.381: U5.12 14.03,50.49 C15.1 C16.1 | C14.2 C16.1 | C16.1 8.6,52.62 J8.2
VIN-POT
  Top 0.254: U3.8 82.55,31.84 83.4,30.99 87.34,30.99 3C5.1 90.23,28.1 92.71,25.61 J2.1
VOUT  (via drill 0.35)
  Bottom 0.254: 4R3.2 16.93,90.39 v16.51,90.81
  pour Top (isolate 0.305): 5.71,89.53 17.14,89.53 17.14,99.06 12.06,99.06 12.06,94.61 5.71,94.61
VOUT-BOOST
  Top 0.254: 3R4.2 80.64,23.5 73.66,16.51 3C3.+
  pour Top (isolate 0.305): 73.03,3.81 73.03,18.41 67.31,24.13 63.5,24.13 63.5,20.95 66.04,18.41 66.04,3.81
VOUT-BUCK
  Top 0.254: 2C3.1 2R2.2 32.38,82.09 31.75,81.45 27.77,81.45 25.8,83.42 2L1.P2
  Top 0.508: 2L1.P2 25.18,87.61 2C2.1 25.18,95.16 J11.1
VSNS  (via drill 0.35)
  Top 0.254: U1.5 16.91,79.85 v18.03,79.85
  Bottom 0.254: 20.78,79.65 20.78,78.74 20.58,78.55 19.04,78.55 18.34,79.25 18.34,79.55 v18.03,79.85 | 20.78,79.65 20.58,79.84 19.98,79.84 4JP2.2 | 20.78,79.65 20.78,84.85 4R3.1

### Text on the board
tPlace: TPS54331 / Buck Converter / github.com/hcbozo | vin | gnd | vout | vout | gnd | vin | av+ | av- | vbat | 14 | 13 | 12 | 11 | 10 | 9 | 8 | 7 | 6 | 5 | 4 | 3 | 2 | 1 | 0 | vin | reset | reset | but=32 | vcc | gnd | but | 15 | 16 | 17 | 18 | 19 | 20 | 21 | 22 | 23 | 24 | 25 | 26 | 27 | 28 | 29 | 30 | 31 | gnd | swclk | swdio | vcc | gnd | vin | ain1 | ain2 | bin1 | bin2 | sleep | fault | vcc | vin | gnd | cs | sclk | mosi | gnd | vin | s0 | s1 | s2 | s3 | out | gnd | vin | vin | gnd | vout | gnd | vin
bPlace: vin | gnd | vout | vout | gnd | vin | WARNING: / DO NOT power / with jumpers unconnected / MAX 5v out!! | 5v | 3.3v | s0 | s1 | s2 | s3 | out | gnd | vin | vin | gnd